# EAGLE design sensors-and-control-r1 (EAGLE 9.1.3)

## Sheet 1 of 3
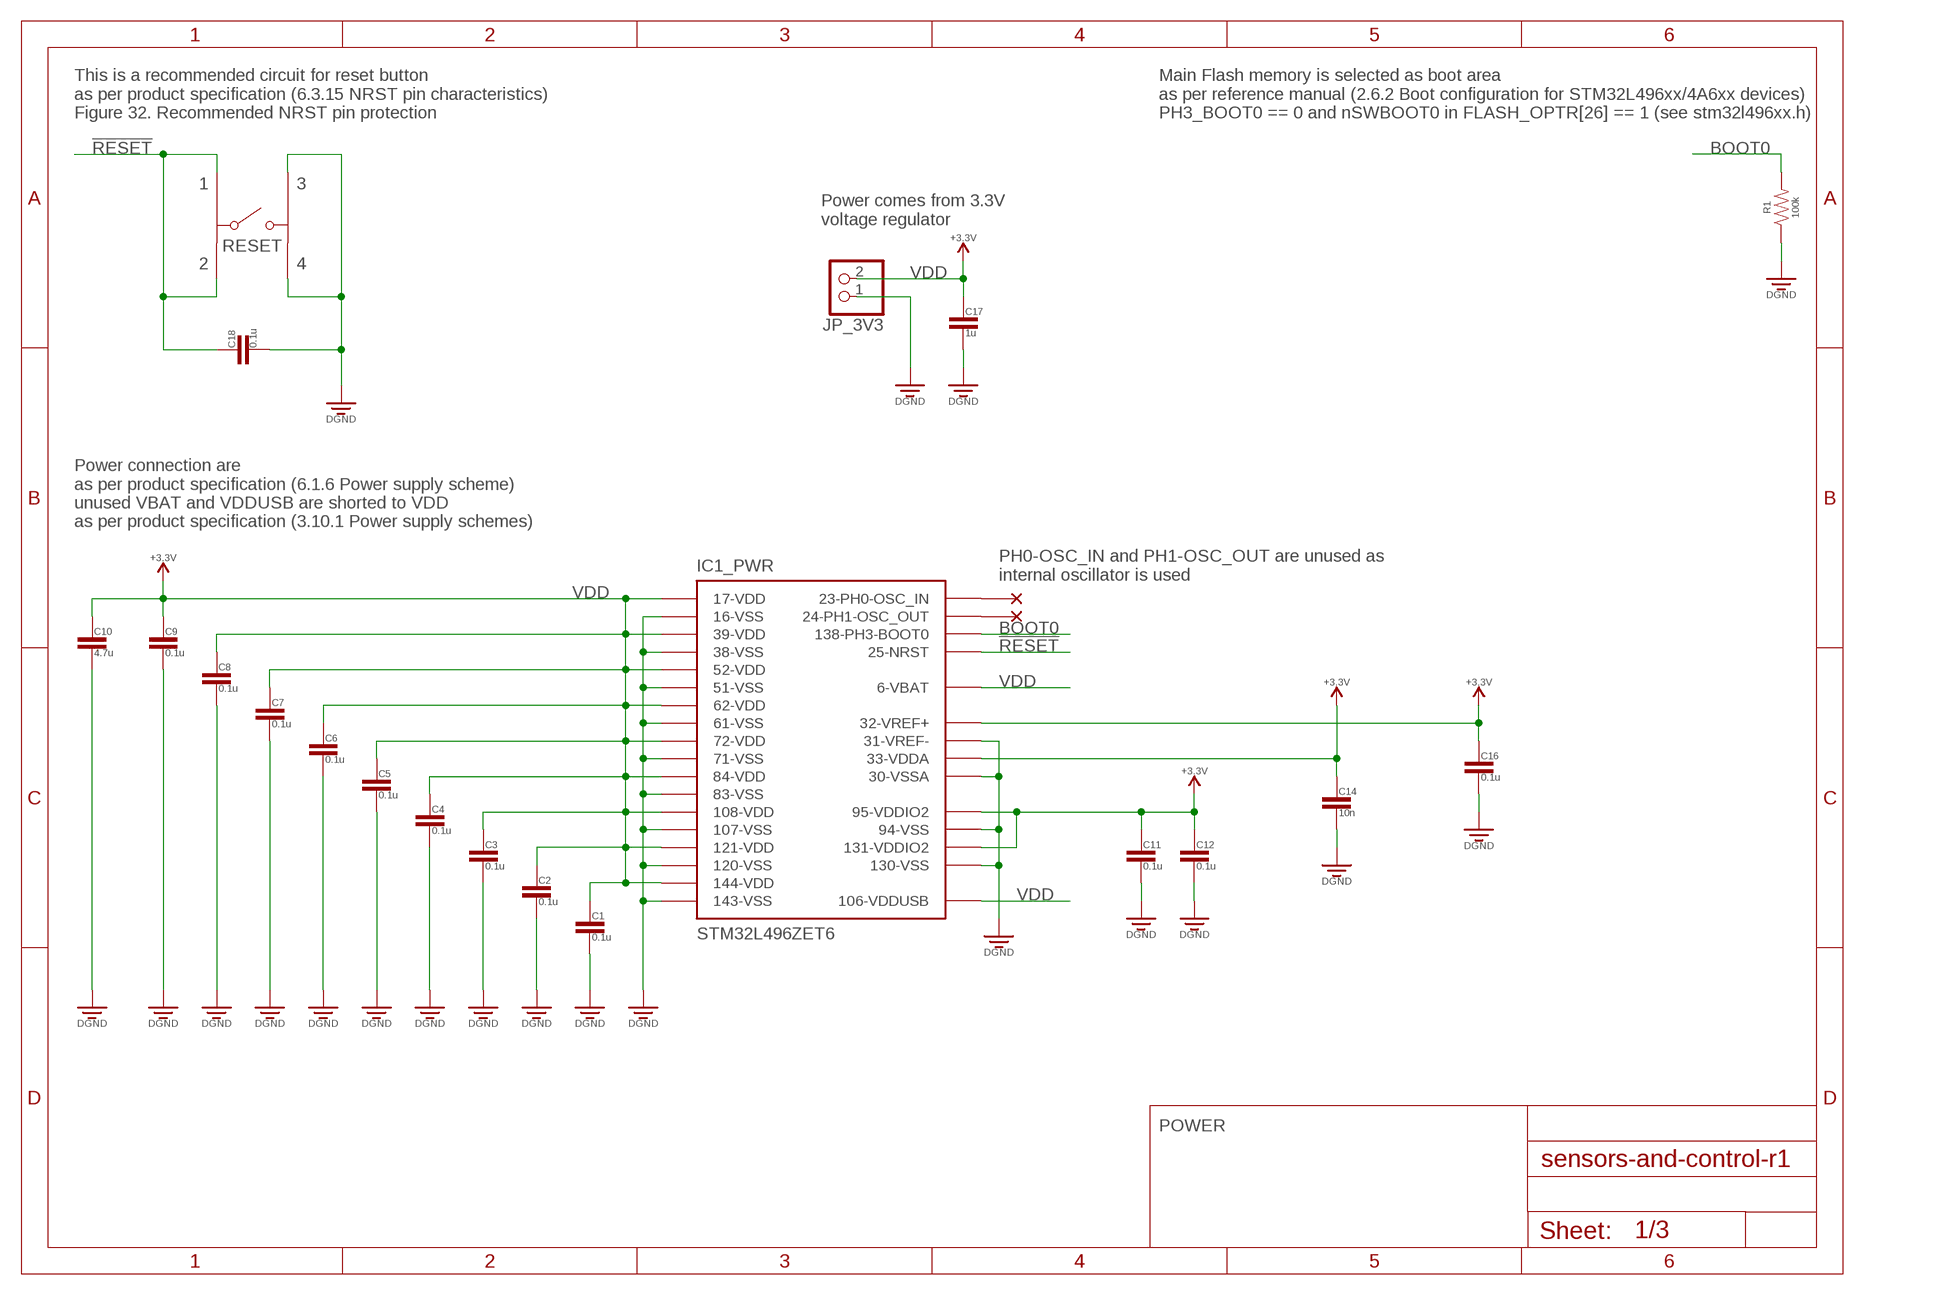
[diagram p0: schematic, sheet 1]

### Parts
C1  0.1u  CAPACITOR0603  [CAPACITOR-0603]
C2  0.1u  CAPACITOR0603  [CAPACITOR-0603]
C3  0.1u  CAPACITOR0603  [CAPACITOR-0603]
C4  0.1u  CAPACITOR0603  [CAPACITOR-0603]
C5  0.1u  CAPACITOR0603  [CAPACITOR-0603]
C6  0.1u  CAPACITOR0603  [CAPACITOR-0603]
C7  0.1u  CAPACITOR0603  [CAPACITOR-0603]
C8  0.1u  CAPACITOR0603  [CAPACITOR-0603]
C9  0.1u  CAPACITOR0603  [CAPACITOR-0603]
C10  4.7u  CAPACITOR0603  [CAPACITOR-0603]
C11  0.1u  CAPACITOR0603  [CAPACITOR-0603]
C12  0.1u  CAPACITOR0603  [CAPACITOR-0603]
C14  10n  CAPACITOR0603  [CAPACITOR-0603]
C16  0.1u  CAPACITOR0603  [CAPACITOR-0603]
C17  1u  CAPACITOR0603  [CAPACITOR-0603]
C18  0.1u  CAPACITOR0603  [CAPACITOR-0603]
IC1  STM32L496ZET6  [LQFP144_20X20]
JP_3V3  WURTH_691103110002  [2_PINS,3.5MM_PITCH]
R1  100k  RESISTOR_0.1W  [RESISTOR-0603]
RESET  FSM6JSMAASTR  [FSMJSM]
SUPPLY1  +3.3V  (no package)
SUPPLY2  +3.3V  (no package)
SUPPLY3  +3.3V  (no package)
SUPPLY4  +3.3V  (no package)
SUPPLY5  +3.3V  (no package)
U$2  NC  (no package)
U$3  NC  (no package)

### Nets
!RESET: C18.1 IC1.25(_PWR:25-NRST) RESET.P$2 RESET.P$4 ; also sheet 2
BOOT0: IC1.138(_PWR:138-PH3-BOOT0) R1.P$2
DGND: C1.2 C2.2 C3.2 C4.2 C5.2 C6.2 C7.2 C8.2 C9.2 C10.2 C11.2 C12.2 C14.2 C16.2 C17.2 C18.2 IC1.16(_PWR:16-VSS) IC1.30(_PWR:30-VSSA) IC1.31(_PWR:31-VREF-) IC1.38(_PWR:38-VSS) IC1.51(_PWR:51-VSS) IC1.61(_PWR:61-VSS) IC1.71(_PWR:71-VSS) IC1.83(_PWR:83-VSS) IC1.94(_PWR:94-VSS) IC1.107(_PWR:107-VSS) IC1.120(_PWR:120-VSS) IC1.130(_PWR:130-VSS) IC1.143(_PWR:143-VSS) JP_3V3.1 R1.P$1 RESET.P$1 RESET.P$3 ; also sheet 2,3
N$4: IC1.24(_PWR:24-PH1-OSC_OUT) U$2.1
N$5: IC1.23(_PWR:23-PH0-OSC_IN) U$3.1
VDD: C1.1 C2.1 C3.1 C4.1 C5.1 C6.1 C7.1 C8.1 C9.1 C10.1 C11.1 C12.1 C14.1 C16.1 C17.1 IC1.6(_PWR:6-VBAT) IC1.17(_PWR:17-VDD) IC1.32(_PWR:32-VREF+) IC1.33(_PWR:33-VDDA) IC1.39(_PWR:39-VDD) IC1.52(_PWR:52-VDD) IC1.62(_PWR:62-VDD) IC1.72(_PWR:72-VDD) IC1.84(_PWR:84-VDD) IC1.95(_PWR:95-VDDIO2) IC1.106(_PWR:106-VDDUSB) IC1.108(_PWR:108-VDD) IC1.121(_PWR:121-VDD) IC1.131(_PWR:131-VDDIO2) IC1.144(_PWR:144-VDD) JP_3V3.2 SUPPLY1.VCC SUPPLY2.VCC SUPPLY3.VCC SUPPLY4.VCC SUPPLY5.VCC ; also sheet 2,3

### Notes on the sheet
- This is a recommended circuit for reset button
  as per product specification (6.3.15 NRST pin characteristics)
  Figure 32. Recommended NRST pin protection
- Main Flash memory is selected as boot area
  as per reference manual (2.6.2 Boot configuration for STM32L496xx/4A6xx devices)
  PH3_BOOT0 == 0 and nSWBOOT0 in FLASH_OPTR[26] == 1 (see stm32l496xx.h)
- Power comes from 3.3V
  voltage regulator
- Power connection are
  as per product specification (6.1.6 Power supply scheme)
  unused VBAT and VDDUSB are shorted to VDD
  as per product specification (3.10.1 Power supply schemes)
- PH0-OSC_IN and PH1-OSC_OUT are unused as
  internal oscillator is used
- POWER

## Sheet 2 of 3
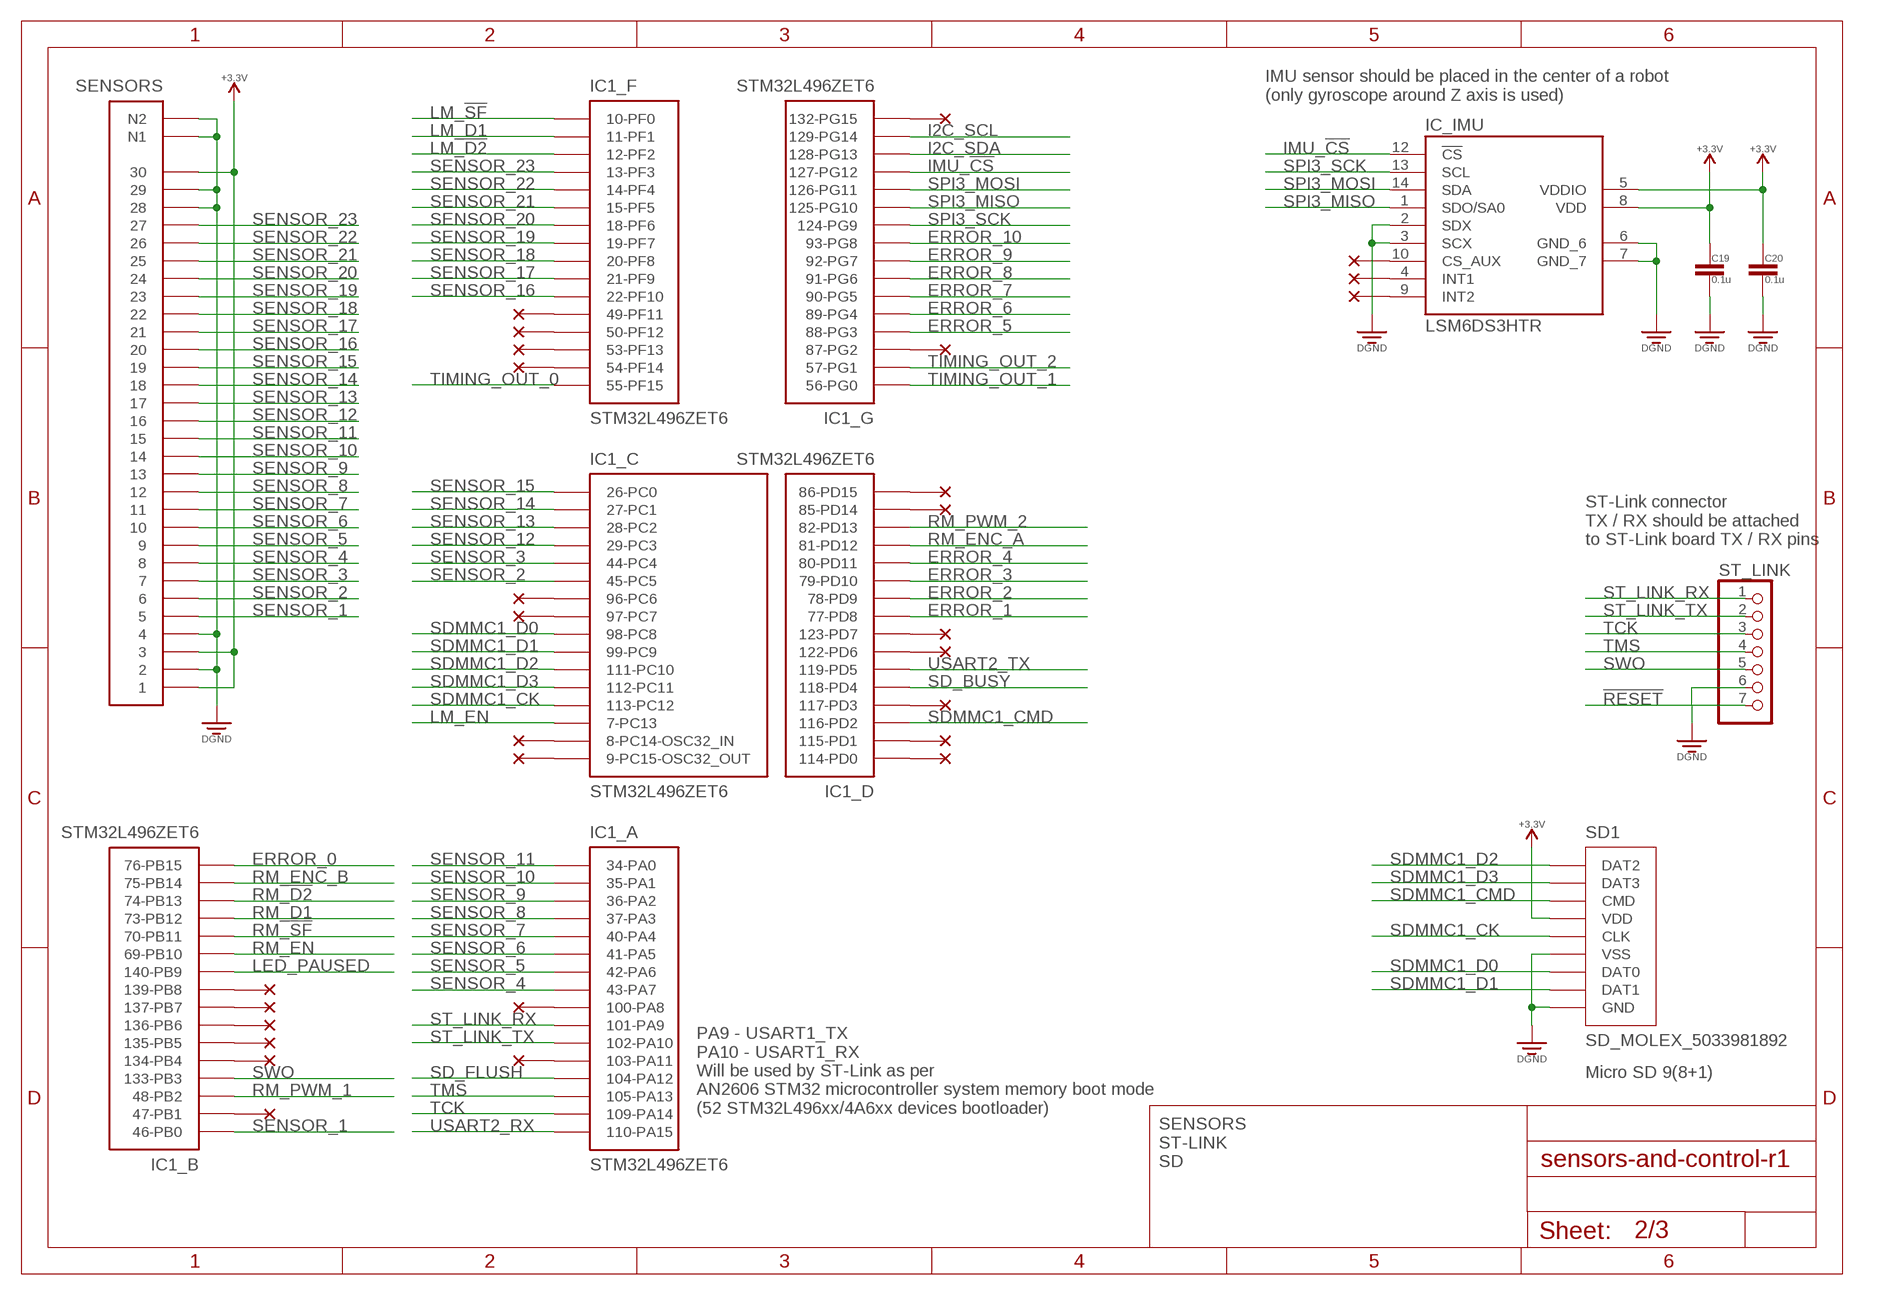
[diagram p1: schematic, sheet 2]

### Parts
C19  0.1u  CAPACITOR0603  [CAPACITOR-0603]
C20  0.1u  CAPACITOR0603  [CAPACITOR-0603]
IC_IMU  LSM6DS3HTR  [LGA-14L]
SD1  SD_MOLEX_5033981892  [SD_MOLEX_5033981892]
SENSORS  MOLEX-502046-3070  [MOLEX-502046-3070]
ST_LINK  PINHD-1X7  [1X07]
SUPPLY6  +3.3V  (no package)
SUPPLY7  +3.3V  (no package)
SUPPLY8  +3.3V  (no package)
SUPPLY9  +3.3V  (no package)
U$1  NC  (no package)
U$4  NC  (no package)
U$5  NC  (no package)
U$11  NC  (no package)
U$12  NC  (no package)
U$13  NC  (no package)
U$14  NC  (no package)
U$15  NC  (no package)
U$16  NC  (no package)
U$17  NC  (no package)
U$18  NC  (no package)
U$19  NC  (no package)
U$20  NC  (no package)
U$21  NC  (no package)
U$22  NC  (no package)
U$23  NC  (no package)
U$24  NC  (no package)
U$25  NC  (no package)
U$26  NC  (no package)
U$27  NC  (no package)
U$28  NC  (no package)
U$29  NC  (no package)
U$31  NC  (no package)
U$32  NC  (no package)
U$33  NC  (no package)
U$34  NC  (no package)
U$35  NC  (no package)
U$36  NC  (no package)

### Nets
!RESET: ST_LINK.7 ; also sheet 1
DGND: C19.2 C20.2 IC_IMU.2(SDX) IC_IMU.3(SCX) IC_IMU.6(GND_6) IC_IMU.7(GND_7) SD1.6(VSS) SD1.DLM(GND) SENSORS.2 SENSORS.4 SENSORS.28 SENSORS.29 SENSORS.NAIL1(N1) SENSORS.NAIL2(N2) ST_LINK.6 ; also sheet 1,3
ERROR_0: IC1.76(_B:76-PB15) ; also sheet 3
ERROR_1: IC1.77(_D:77-PD8) ; also sheet 3
ERROR_2: IC1.78(_D:78-PD9) ; also sheet 3
ERROR_3: IC1.79(_D:79-PD10) ; also sheet 3
ERROR_4: IC1.80(_D:80-PD11) ; also sheet 3
ERROR_5: IC1.88(_G:88-PG3) ; also sheet 3
ERROR_6: IC1.89(_G:89-PG4) ; also sheet 3
ERROR_7: IC1.90(_G:90-PG5) ; also sheet 3
ERROR_8: IC1.91(_G:91-PG6) ; also sheet 3
ERROR_9: IC1.92(_G:92-PG7) ; also sheet 3
ERROR_10: IC1.93(_G:93-PG8) ; also sheet 3
I2C_SCL: IC1.129(_G:129-PG14) ; also sheet 3
I2C_SDA: IC1.128(_G:128-PG13) ; also sheet 3
IMU_!CS: IC1.127(_G:127-PG12) IC_IMU.12(!CS!)
LED_PAUSED: IC1.140(_B:140-PB9) ; also sheet 3
LM_!D2: IC1.12(_F:12-PF2) ; also sheet 3
LM_!SF: IC1.10(_F:10-PF0) ; also sheet 3
LM_D1: IC1.11(_F:11-PF1) ; also sheet 3
LM_EN: IC1.7(_C:7-PC13) ; also sheet 3
N$1: IC_IMU.10(CS_AUX) U$1.1
N$2: IC_IMU.4(INT1) U$4.1
N$6: IC_IMU.9(INT2) U$5.1
N$27: IC1.114(_D:114-PD0) U$11.1
N$28: IC1.115(_D:115-PD1) U$12.1
N$29: IC1.117(_D:117-PD3) U$13.1
N$30: IC1.103(_A:103-PA11) U$14.1
N$31: IC1.122(_D:122-PD6) U$15.1
N$32: IC1.123(_D:123-PD7) U$16.1
N$33: IC1.85(_D:85-PD14) U$17.1
N$34: IC1.86(_D:86-PD15) U$18.1
N$35: IC1.87(_G:87-PG2) U$19.1
N$36: IC1.49(_F:49-PF11) U$20.1
N$37: IC1.50(_F:50-PF12) U$21.1
N$38: IC1.53(_F:53-PF13) U$22.1
N$39: IC1.54(_F:54-PF14) U$23.1
N$40: IC1.96(_C:96-PC6) U$24.1
N$41: IC1.97(_C:97-PC7) U$25.1
N$42: IC1.8(_C:8-PC14-OSC32_IN) U$26.1
N$43: IC1.9(_C:9-PC15-OSC32_OUT) U$27.1
N$44: IC1.100(_A:100-PA8) U$28.1
N$45: IC1.132(_G:132-PG15) U$29.1
N$47: IC1.137(_B:137-PB7) U$31.1
N$48: IC1.139(_B:139-PB8) U$32.1
N$49: IC1.136(_B:136-PB6) U$33.1
N$50: IC1.135(_B:135-PB5) U$34.1
N$51: IC1.134(_B:134-PB4) U$35.1
N$52: IC1.47(_B:47-PB1) U$36.1
RM_!D2: IC1.74(_B:74-PB13) ; also sheet 3
RM_!SF: IC1.70(_B:70-PB11) ; also sheet 3
RM_D1: IC1.73(_B:73-PB12) ; also sheet 3
RM_EN: IC1.69(_B:69-PB10) ; also sheet 3
RM_ENC_A: IC1.81(_D:81-PD12) ; also sheet 3
RM_ENC_B: IC1.75(_B:75-PB14) ; also sheet 3
RM_PWM_1: IC1.48(_B:48-PB2) ; also sheet 3
RM_PWM_2: IC1.82(_D:82-PD13) ; also sheet 3
SD_BUSY: IC1.118(_D:118-PD4) ; also sheet 3
SD_FLUSH: IC1.104(_A:104-PA12) ; also sheet 3
SDMMC1_CK: IC1.113(_C:113-PC12) SD1.5(CLK)
SDMMC1_CMD: IC1.116(_D:116-PD2) SD1.3(CMD)
SDMMC1_D0: IC1.98(_C:98-PC8) SD1.7(DAT0)
SDMMC1_D1: IC1.99(_C:99-PC9) SD1.8(DAT1)
SDMMC1_D2: IC1.111(_C:111-PC10) SD1.1(DAT2)
SDMMC1_D3: IC1.112(_C:112-PC11) SD1.2(DAT3)
SENSOR_1: IC1.46(_B:46-PB0) SENSORS.5
SENSOR_2: IC1.45(_C:45-PC5) SENSORS.6
SENSOR_3: IC1.44(_C:44-PC4) SENSORS.7
SENSOR_4: IC1.43(_A:43-PA7) SENSORS.8
SENSOR_5: IC1.42(_A:42-PA6) SENSORS.9
SENSOR_6: IC1.41(_A:41-PA5) SENSORS.10
SENSOR_7: IC1.40(_A:40-PA4) SENSORS.11
SENSOR_8: IC1.37(_A:37-PA3) SENSORS.12
SENSOR_9: IC1.36(_A:36-PA2) SENSORS.13
SENSOR_10: IC1.35(_A:35-PA1) SENSORS.14
SENSOR_11: IC1.34(_A:34-PA0) SENSORS.15
SENSOR_12: IC1.29(_C:29-PC3) SENSORS.16
SENSOR_13: IC1.28(_C:28-PC2) SENSORS.17
SENSOR_14: IC1.27(_C:27-PC1) SENSORS.18
SENSOR_15: IC1.26(_C:26-PC0) SENSORS.19
SENSOR_16: IC1.22(_F:22-PF10) SENSORS.20
SENSOR_17: IC1.21(_F:21-PF9) SENSORS.21
SENSOR_18: IC1.20(_F:20-PF8) SENSORS.22
SENSOR_19: IC1.19(_F:19-PF7) SENSORS.23
SENSOR_20: IC1.18(_F:18-PF6) SENSORS.24
SENSOR_21: IC1.15(_F:15-PF5) SENSORS.25
SENSOR_22: IC1.14(_F:14-PF4) SENSORS.26
SENSOR_23: IC1.13(_F:13-PF3) SENSORS.27
SPI3_MISO: IC1.125(_G:125-PG10) IC_IMU.1(SDO/SA0)
SPI3_MOSI: IC1.126(_G:126-PG11) IC_IMU.14(SDA)
SPI3_SCK: IC1.124(_G:124-PG9) IC_IMU.13(SCL)
ST_LINK_RX: IC1.101(_A:101-PA9) ST_LINK.1
ST_LINK_TX: IC1.102(_A:102-PA10) ST_LINK.2
SWO: IC1.133(_B:133-PB3) ST_LINK.5
TCK: IC1.109(_A:109-PA14) ST_LINK.3
TIMING_OUT_0: IC1.55(_F:55-PF15) ; also sheet 3
TIMING_OUT_1: IC1.56(_G:56-PG0) ; also sheet 3
TIMING_OUT_2: IC1.57(_G:57-PG1) ; also sheet 3
TMS: IC1.105(_A:105-PA13) ST_LINK.4
USART2_RX: IC1.110(_A:110-PA15) ; also sheet 3
USART2_TX: IC1.119(_D:119-PD5) ; also sheet 3
VDD: C19.1 C20.1 IC_IMU.5(VDDIO) IC_IMU.8(VDD) SD1.4(VDD) SENSORS.1 SENSORS.3 SENSORS.30 SUPPLY6.VCC SUPPLY7.VCC SUPPLY8.VCC SUPPLY9.VCC ; also sheet 1,3

### Notes on the sheet
- IMU sensor should be placed in the center of a robot
  (only gyroscope around Z axis is used)
- ST-Link connector
  TX / RX should be attached
  to ST-Link board TX / RX pins
- Micro SD 9(8+1)
- PA9 - USART1_TX
  PA10 - USART1_RX
  Will be used by ST-Link as per
  AN2606 STM32 microcontroller system memory boot mode
  (52 STM32L496xx/4A6xx devices bootloader)
- SENSORS
  ST-LINK
  SD

## Sheet 3 of 3
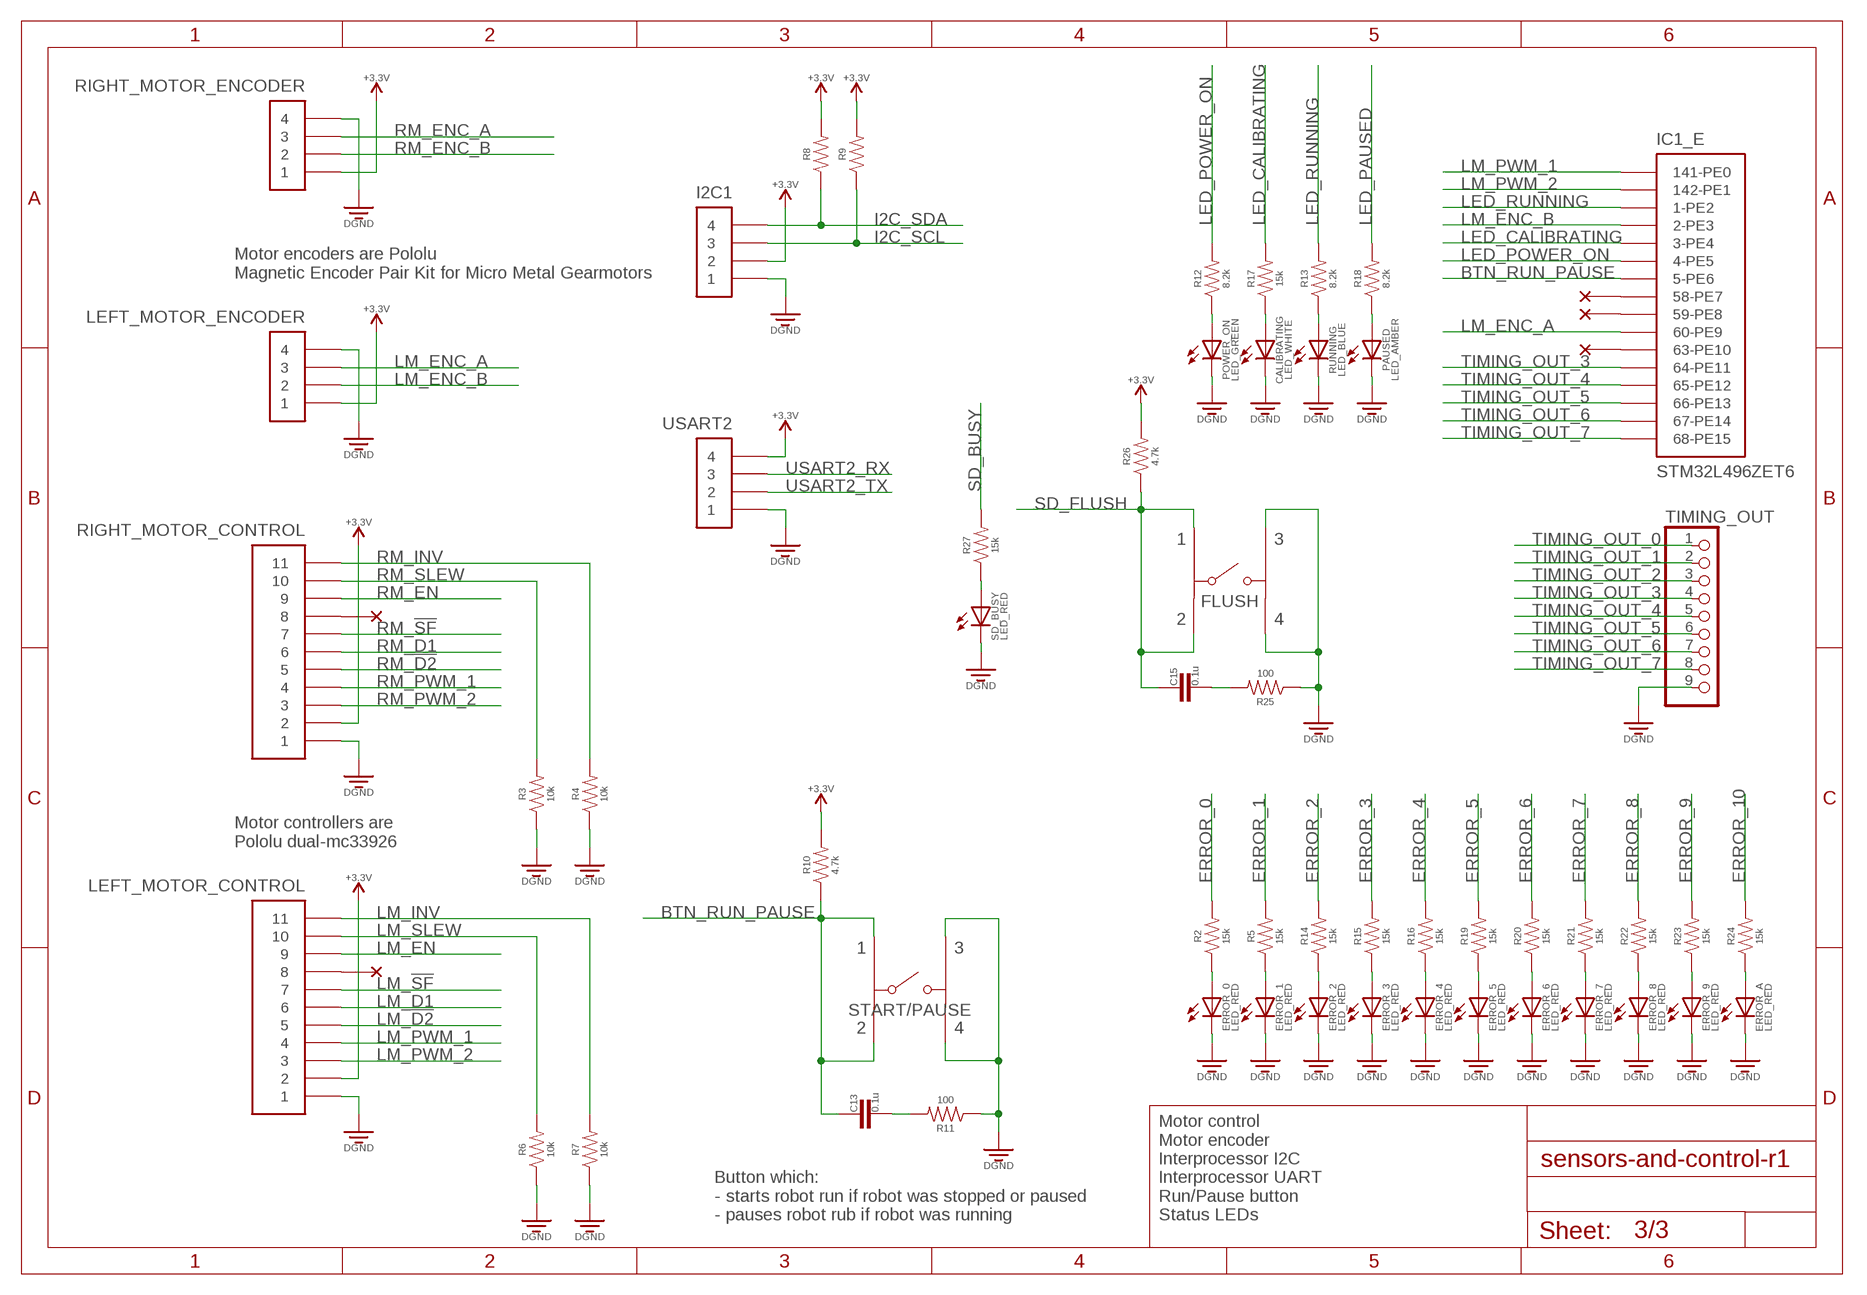
[diagram p2: schematic, sheet 3]

### Parts
C13  0.1u  CAPACITOR0603  [CAPACITOR-0603]
C15  0.1u  CAPACITOR0603  [CAPACITOR-0603]
CALIBRATING  LED_WHITE  [ESS_II_TYPE_LED]
ERROR_0  LED_RED  [ESS_II_TYPE_LED]
ERROR_1  LED_RED  [ESS_II_TYPE_LED]
ERROR_2  LED_RED  [ESS_II_TYPE_LED]
ERROR_3  LED_RED  [ESS_II_TYPE_LED]
ERROR_4  LED_RED  [ESS_II_TYPE_LED]
ERROR_5  LED_RED  [ESS_II_TYPE_LED]
ERROR_6  LED_RED  [ESS_II_TYPE_LED]
ERROR_7  LED_RED  [ESS_II_TYPE_LED]
ERROR_8  LED_RED  [ESS_II_TYPE_LED]
ERROR_9  LED_RED  [ESS_II_TYPE_LED]
ERROR_A  LED_RED  [ESS_II_TYPE_LED]
FLUSH  FSM6JSMAASTR  [FSMJSM]
I2C1  1X4  [MOLEX-70553-0003]
LEFT_MOTOR_CONTROL  1X11  [MOLEX-70553-0010]
LEFT_MOTOR_ENCODER  1X4  [MOLEX-70553-0003]
PAUSED  LED_AMBER  [ESS_II_TYPE_LED]
POWER_ON  LED_GREEN  [ESS_II_TYPE_LED]
R2  15k  RESISTOR_0.1W  [RESISTOR-0603]
R3  10k  RESISTOR_0.1W  [RESISTOR-0603]
R4  10k  RESISTOR_0.1W  [RESISTOR-0603]
R5  15k  RESISTOR_0.1W  [RESISTOR-0603]
R6  10k  RESISTOR_0.1W  [RESISTOR-0603]
R7  10k  RESISTOR_0.1W  [RESISTOR-0603]
R8  RESISTOR_0.1W  [RESISTOR-0603]
R9  RESISTOR_0.1W  [RESISTOR-0603]
R10  4.7k  RESISTOR_0.1W  [RESISTOR-0603]
R11  100  RESISTOR_0.1W  [RESISTOR-0603]
R12  8.2k  RESISTOR_0.1W  [RESISTOR-0603]
R13  8.2k  RESISTOR_0.1W  [RESISTOR-0603]
R14  15k  RESISTOR_0.1W  [RESISTOR-0603]
R15  15k  RESISTOR_0.1W  [RESISTOR-0603]
R16  15k  RESISTOR_0.1W  [RESISTOR-0603]
R17  15k  RESISTOR_0.1W  [RESISTOR-0603]
R18  8.2k  RESISTOR_0.1W  [RESISTOR-0603]
R19  15k  RESISTOR_0.1W  [RESISTOR-0603]
R20  15k  RESISTOR_0.1W  [RESISTOR-0603]
R21  15k  RESISTOR_0.1W  [RESISTOR-0603]
R22  15k  RESISTOR_0.1W  [RESISTOR-0603]
R23  15k  RESISTOR_0.1W  [RESISTOR-0603]
R24  15k  RESISTOR_0.1W  [RESISTOR-0603]
R25  100  RESISTOR_0.1W  [RESISTOR-0603]
R26  4.7k  RESISTOR_0.1W  [RESISTOR-0603]
R27  15k  RESISTOR_0.1W  [RESISTOR-0603]
RIGHT_MOTOR_CONTROL  1X11  [MOLEX-70553-0010]
RIGHT_MOTOR_ENCODER  1X4  [MOLEX-70553-0003]
RUNNING  LED_BLUE  [ESS_II_TYPE_LED]
SD_BUSY  LED_RED  [ESS_II_TYPE_LED]
START/PAUSE  FSM6JSMAASTR  [FSMJSM]
SUPPLY10  +3.3V  (no package)
SUPPLY11  +3.3V  (no package)
SUPPLY12  +3.3V  (no package)
SUPPLY13  +3.3V  (no package)
SUPPLY16  +3.3V  (no package)
SUPPLY17  +3.3V  (no package)
SUPPLY18  +3.3V  (no package)
SUPPLY19  +3.3V  (no package)
SUPPLY20  +3.3V  (no package)
TIMING_OUT  PINHD-1X9  [1X09]
U$6  NC  (no package)
U$7  NC  (no package)
U$8  NC  (no package)
U$9  NC  (no package)
U$10  NC  (no package)
USART2  1X4  [MOLEX-70553-0003]
VDD  +3.3V  (no package)

### Nets
BTN_RUN_PAUSE: C13.1 IC1.5(_E:5-PE6) R10.P$1 START/PAUSE.P$2 START/PAUSE.P$4
DGND: CALIBRATING.P$2(C) ERROR_0.P$2(C) ERROR_1.P$2(C) ERROR_2.P$2(C) ERROR_3.P$2(C) ERROR_4.P$2(C) ERROR_5.P$2(C) ERROR_6.P$2(C) ERROR_7.P$2(C) ERROR_8.P$2(C) ERROR_9.P$2(C) ERROR_A.P$2(C) FLUSH.P$1 FLUSH.P$3 I2C1.1 LEFT_MOTOR_CONTROL.P$1 LEFT_MOTOR_ENCODER.4 PAUSED.P$2(C) POWER_ON.P$2(C) R3.P$1 R4.P$1 R6.P$1 R7.P$1 R11.P$1 R25.P$1 RIGHT_MOTOR_CONTROL.P$1 RIGHT_MOTOR_ENCODER.4 RUNNING.P$2(C) SD_BUSY.P$2(C) START/PAUSE.P$1 START/PAUSE.P$3 TIMING_OUT.9 USART2.1 ; also sheet 1,2
ERROR_0: R2.P$2 ; also sheet 2
ERROR_1: R5.P$2 ; also sheet 2
ERROR_2: R14.P$2 ; also sheet 2
ERROR_3: R15.P$2 ; also sheet 2
ERROR_4: R16.P$2 ; also sheet 2
ERROR_5: R19.P$2 ; also sheet 2
ERROR_6: R20.P$2 ; also sheet 2
ERROR_7: R21.P$2 ; also sheet 2
ERROR_8: R22.P$2 ; also sheet 2
ERROR_9: R23.P$2 ; also sheet 2
ERROR_10: R24.P$2 ; also sheet 2
I2C_SCL: I2C1.3 R9.P$1 ; also sheet 2
I2C_SDA: I2C1.4 R8.P$1 ; also sheet 2
LED_CALIBRATING: IC1.3(_E:3-PE4) R17.P$2
LED_PAUSED: R18.P$2 ; also sheet 2
LED_POWER_ON: IC1.4(_E:4-PE5) R12.P$2
LED_RUNNING: IC1.1(_E:1-PE2) R13.P$2
LM_!D2: LEFT_MOTOR_CONTROL.P$5 ; also sheet 2
LM_!SF: LEFT_MOTOR_CONTROL.P$7 ; also sheet 2
LM_D1: LEFT_MOTOR_CONTROL.P$6 ; also sheet 2
LM_EN: LEFT_MOTOR_CONTROL.P$9 ; also sheet 2
LM_ENC_A: IC1.60(_E:60-PE9) LEFT_MOTOR_ENCODER.3
LM_ENC_B: IC1.2(_E:2-PE3) LEFT_MOTOR_ENCODER.2
LM_INV: LEFT_MOTOR_CONTROL.P$11 R7.P$2
LM_PWM_1: IC1.141(_E:141-PE0) LEFT_MOTOR_CONTROL.P$4
LM_PWM_2: IC1.142(_E:142-PE1) LEFT_MOTOR_CONTROL.P$3
LM_SLEW: LEFT_MOTOR_CONTROL.P$10 R6.P$2
N$3: ERROR_0.P$1(A) R2.P$1
N$7: RIGHT_MOTOR_CONTROL.P$8 U$6.1
N$8: LEFT_MOTOR_CONTROL.P$8 U$7.1
N$9: ERROR_1.P$1(A) R5.P$1
N$10: POWER_ON.P$1(A) R12.P$1
N$11: C13.2 R11.P$2
N$12: R13.P$1 RUNNING.P$1(A)
N$13: ERROR_2.P$1(A) R14.P$1
N$14: ERROR_3.P$1(A) R15.P$1
N$15: ERROR_4.P$1(A) R16.P$1
N$16: CALIBRATING.P$1(A) R17.P$1
N$17: PAUSED.P$1(A) R18.P$1
N$18: ERROR_5.P$1(A) R19.P$1
N$19: ERROR_6.P$1(A) R20.P$1
N$20: ERROR_7.P$1(A) R21.P$1
N$21: ERROR_8.P$1(A) R22.P$1
N$22: ERROR_9.P$1(A) R23.P$1
N$23: ERROR_A.P$1(A) R24.P$1
N$24: IC1.63(_E:63-PE10) U$8.1
N$25: IC1.59(_E:59-PE8) U$9.1
N$26: IC1.58(_E:58-PE7) U$10.1
N$53: C15.2 R25.P$2
N$55: R27.P$1 SD_BUSY.P$1(A)
RM_!D2: RIGHT_MOTOR_CONTROL.P$5 ; also sheet 2
RM_!SF: RIGHT_MOTOR_CONTROL.P$7 ; also sheet 2
RM_D1: RIGHT_MOTOR_CONTROL.P$6 ; also sheet 2
RM_EN: RIGHT_MOTOR_CONTROL.P$9 ; also sheet 2
RM_ENC_A: RIGHT_MOTOR_ENCODER.3 ; also sheet 2
RM_ENC_B: RIGHT_MOTOR_ENCODER.2 ; also sheet 2
RM_INV: R4.P$2 RIGHT_MOTOR_CONTROL.P$11
RM_PWM_1: RIGHT_MOTOR_CONTROL.P$4 ; also sheet 2
RM_PWM_2: RIGHT_MOTOR_CONTROL.P$3 ; also sheet 2
RM_SLEW: R3.P$2 RIGHT_MOTOR_CONTROL.P$10
SD_BUSY: R27.P$2 ; also sheet 2
SD_FLUSH: C15.1 FLUSH.P$2 FLUSH.P$4 R26.P$1 ; also sheet 2
TIMING_OUT_0: TIMING_OUT.1 ; also sheet 2
TIMING_OUT_1: TIMING_OUT.2 ; also sheet 2
TIMING_OUT_2: TIMING_OUT.3 ; also sheet 2
TIMING_OUT_3: IC1.64(_E:64-PE11) TIMING_OUT.4
TIMING_OUT_4: IC1.65(_E:65-PE12) TIMING_OUT.5
TIMING_OUT_5: IC1.66(_E:66-PE13) TIMING_OUT.6
TIMING_OUT_6: IC1.67(_E:67-PE14) TIMING_OUT.7
TIMING_OUT_7: IC1.68(_E:68-PE15) TIMING_OUT.8
USART2_RX: USART2.3 ; also sheet 2
USART2_TX: USART2.2 ; also sheet 2
VDD: I2C1.2 LEFT_MOTOR_CONTROL.P$2 LEFT_MOTOR_ENCODER.1 R8.P$2 R9.P$2 R10.P$2 R26.P$2 RIGHT_MOTOR_CONTROL.P$2 RIGHT_MOTOR_ENCODER.1 SUPPLY10.VCC SUPPLY11.VCC SUPPLY12.VCC SUPPLY13.VCC SUPPLY16.VCC SUPPLY17.VCC SUPPLY18.VCC SUPPLY19.VCC SUPPLY20.VCC USART2.4 VDD.VCC ; also sheet 1,2

### Notes on the sheet
- Motor encoders are Pololu
  Magnetic Encoder Pair Kit for Micro Metal Gearmotors
- Motor controllers are
  Pololu dual-mc33926
- Button which:
  - starts robot run if robot was stopped or paused
  - pauses robot rub if robot was running
- Motor control
  Motor encoder
  Interprocessor I2C
  Interprocessor UART
  Run/Pause button
  Status LEDs

## Library data of the parts
C1-C20 = capacitors:CAPACITOR
CALIBRATING = led:LED_WHITE
ERROR_0 ERROR_1-ERROR_9 ERROR_A SD_BUSY = led:LED_RED
FLUSH RESET START/PAUSE = switches:FSM6JSMAASTR
I2C1 LEFT_MOTOR_ENCODER RIGHT_MOTOR_ENCODER USART2 = connectors:1X4
IC1 = mcu:STM32L496ZET6
IC_IMU = sensors:LSM6DS3HTR
JP_3V3 = connectors-power:WURTH_691103110002
LEFT_MOTOR_CONTROL RIGHT_MOTOR_CONTROL = connectors:1X11
PAUSED = led:LED_AMBER
POWER_ON = led:LED_GREEN
R1-R27 = resistors:RESISTOR_0.1W
RUNNING = led:LED_BLUE
SD1 = memory-card-interfaces:SD_MOLEX_5033981892
SENSORS = connectors:MOLEX-502046-3070
ST_LINK = pin-headers:PINHD-1X7: PIN HEADER
SUPPLY1-SUPPLY13 SUPPLY16-SUPPLY20 VDD = voltage-ground:+3.3V: +3.3V Voltage Supply Positive voltage supply (traditionally for a BJT device, C=collector).
TIMING_OUT = pin-headers:PINHD-1X9: PIN HEADER
U$1-U$29 U$31-U$36 = voltage-ground:NC

## Board
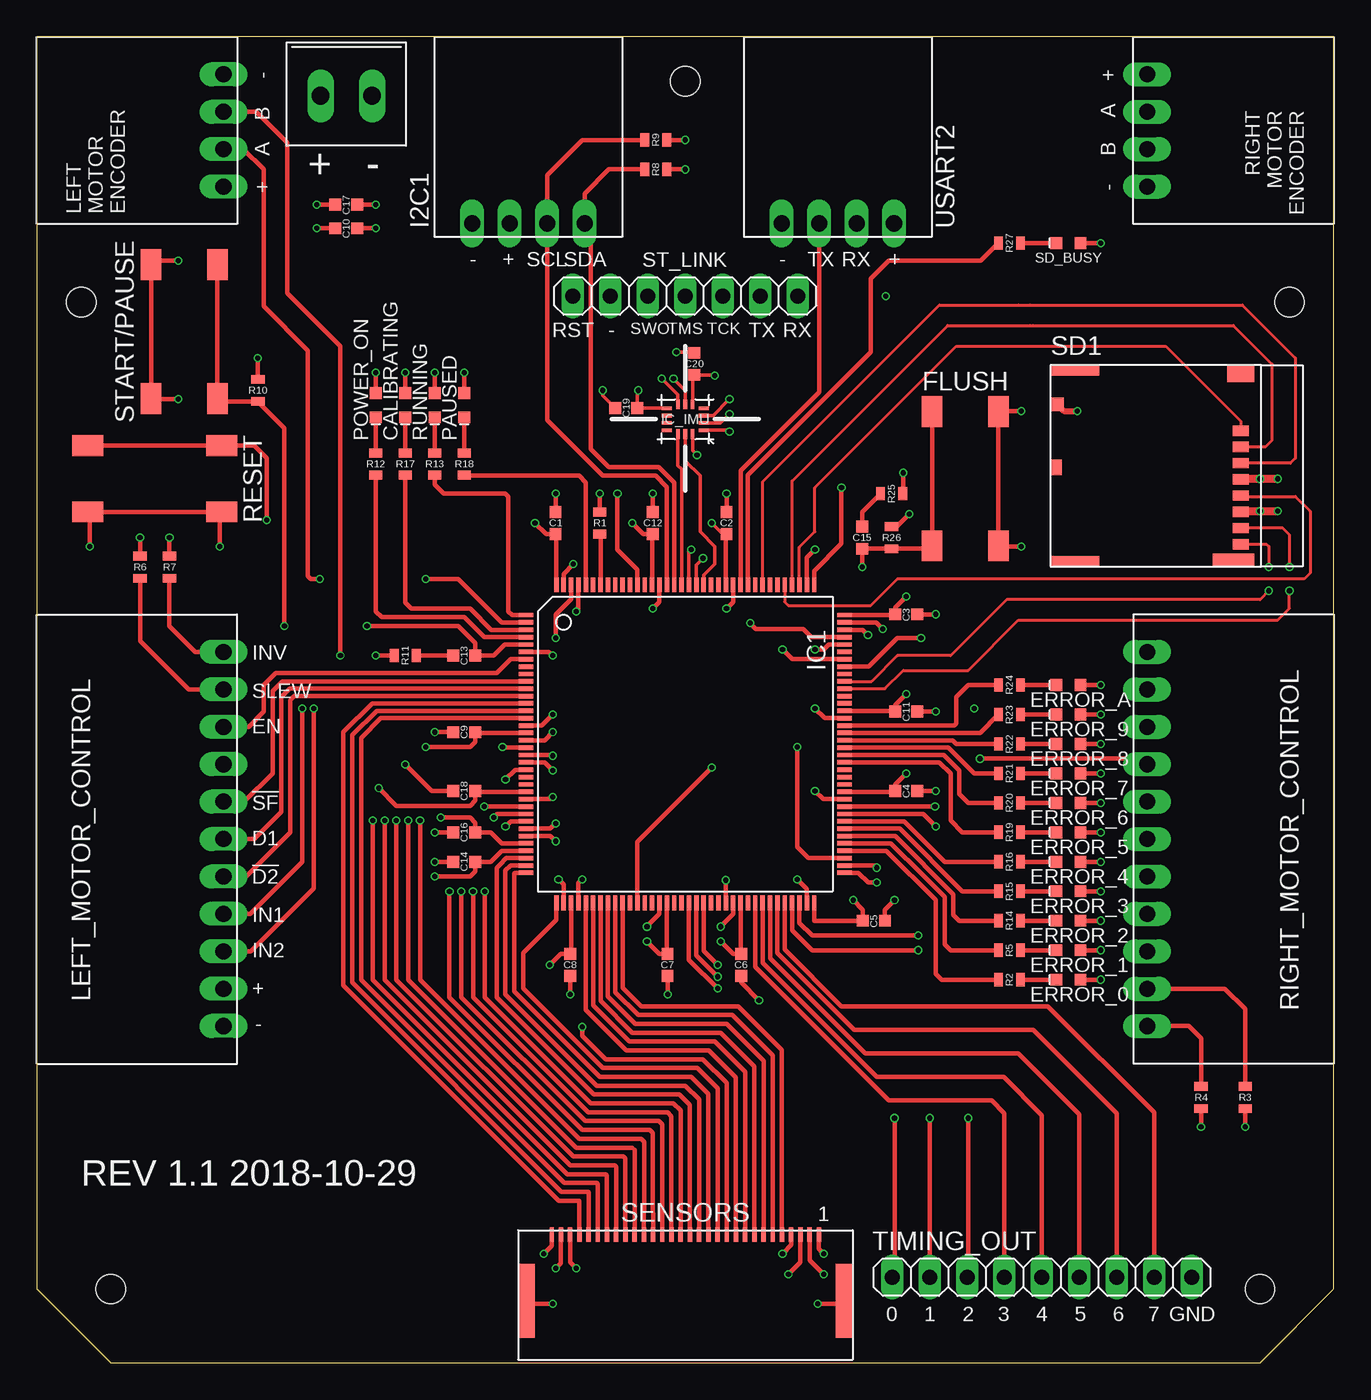
[diagram p3: board, top side]
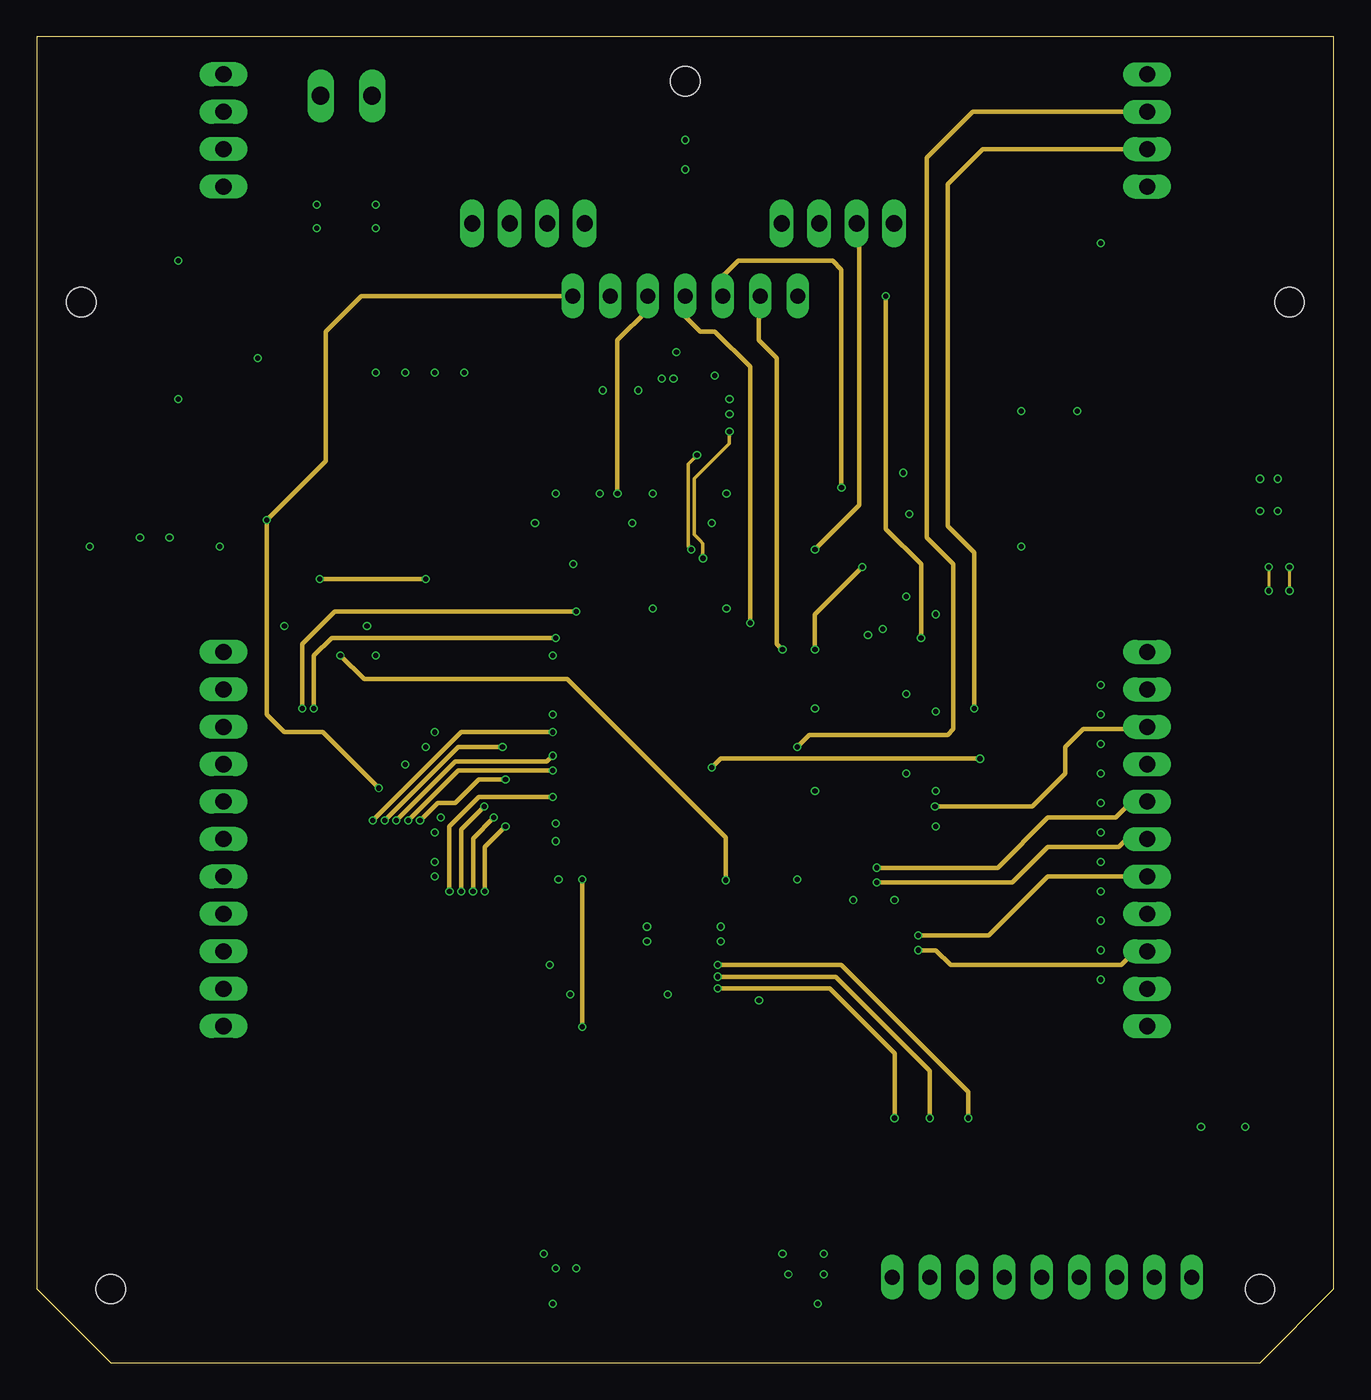
[diagram p4: board, inner layer Route2]
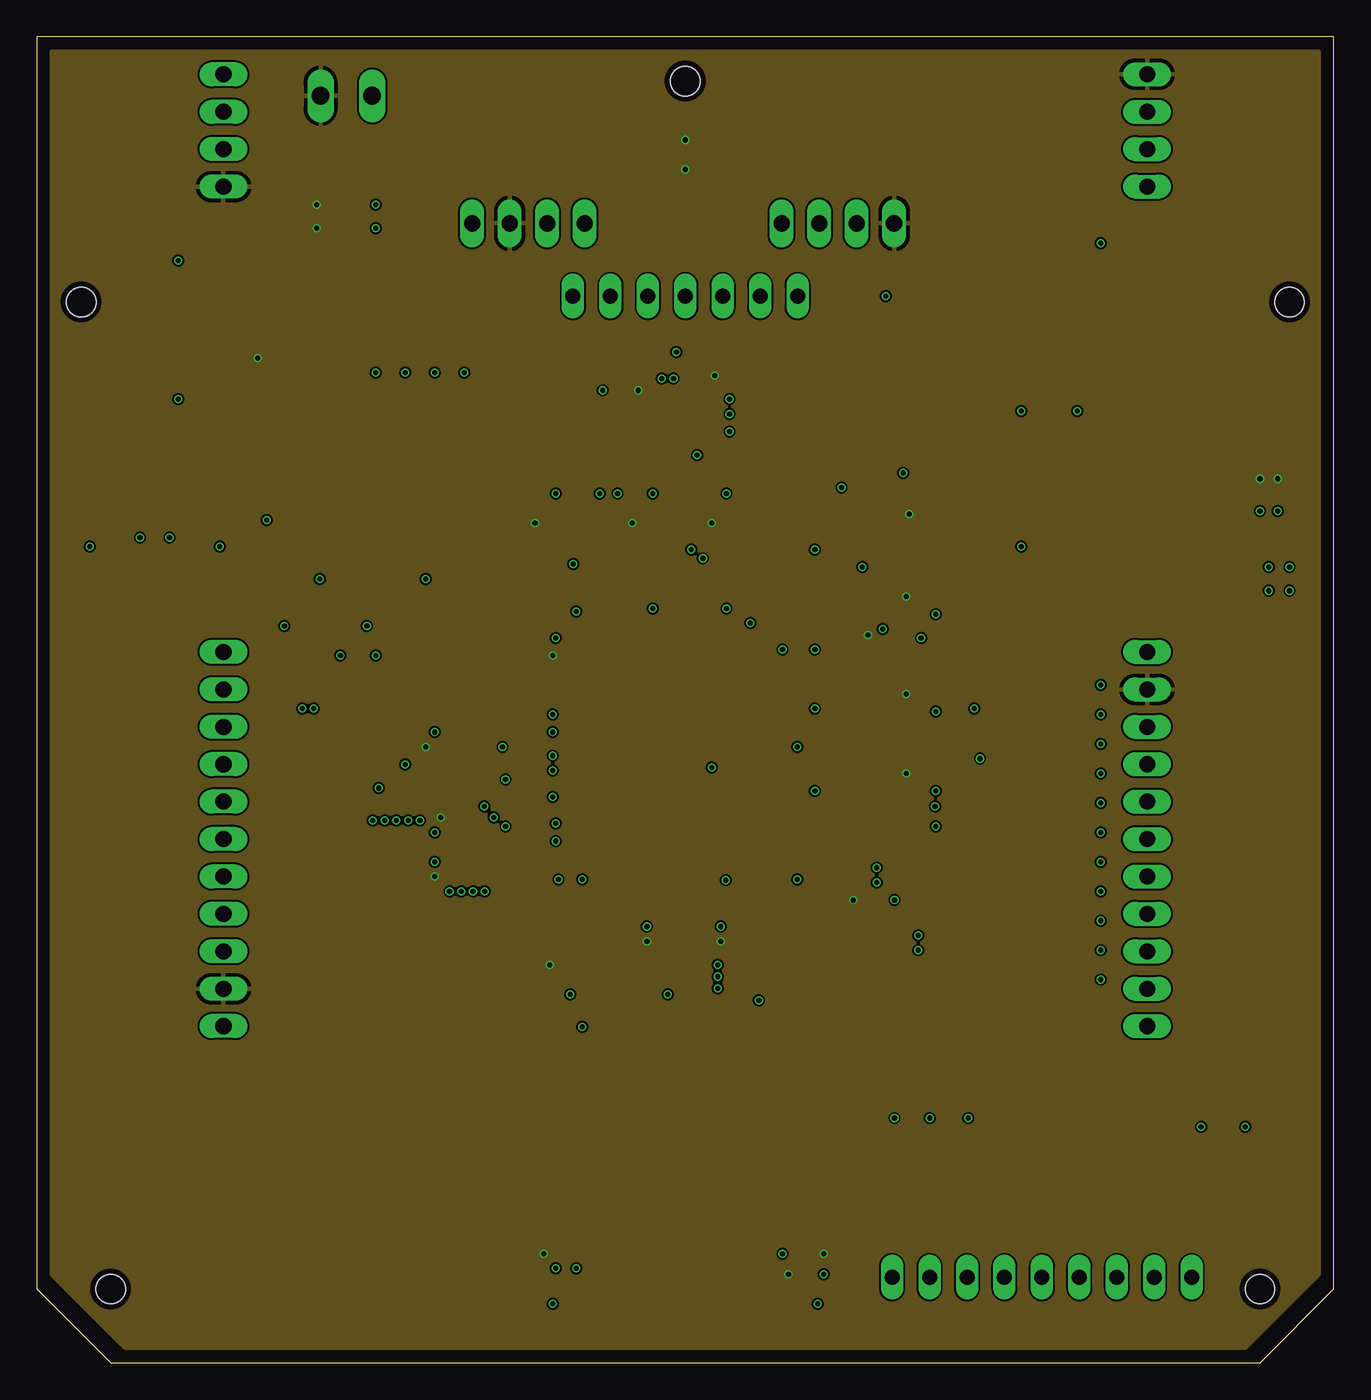
[diagram p5: board, inner layer Route15]
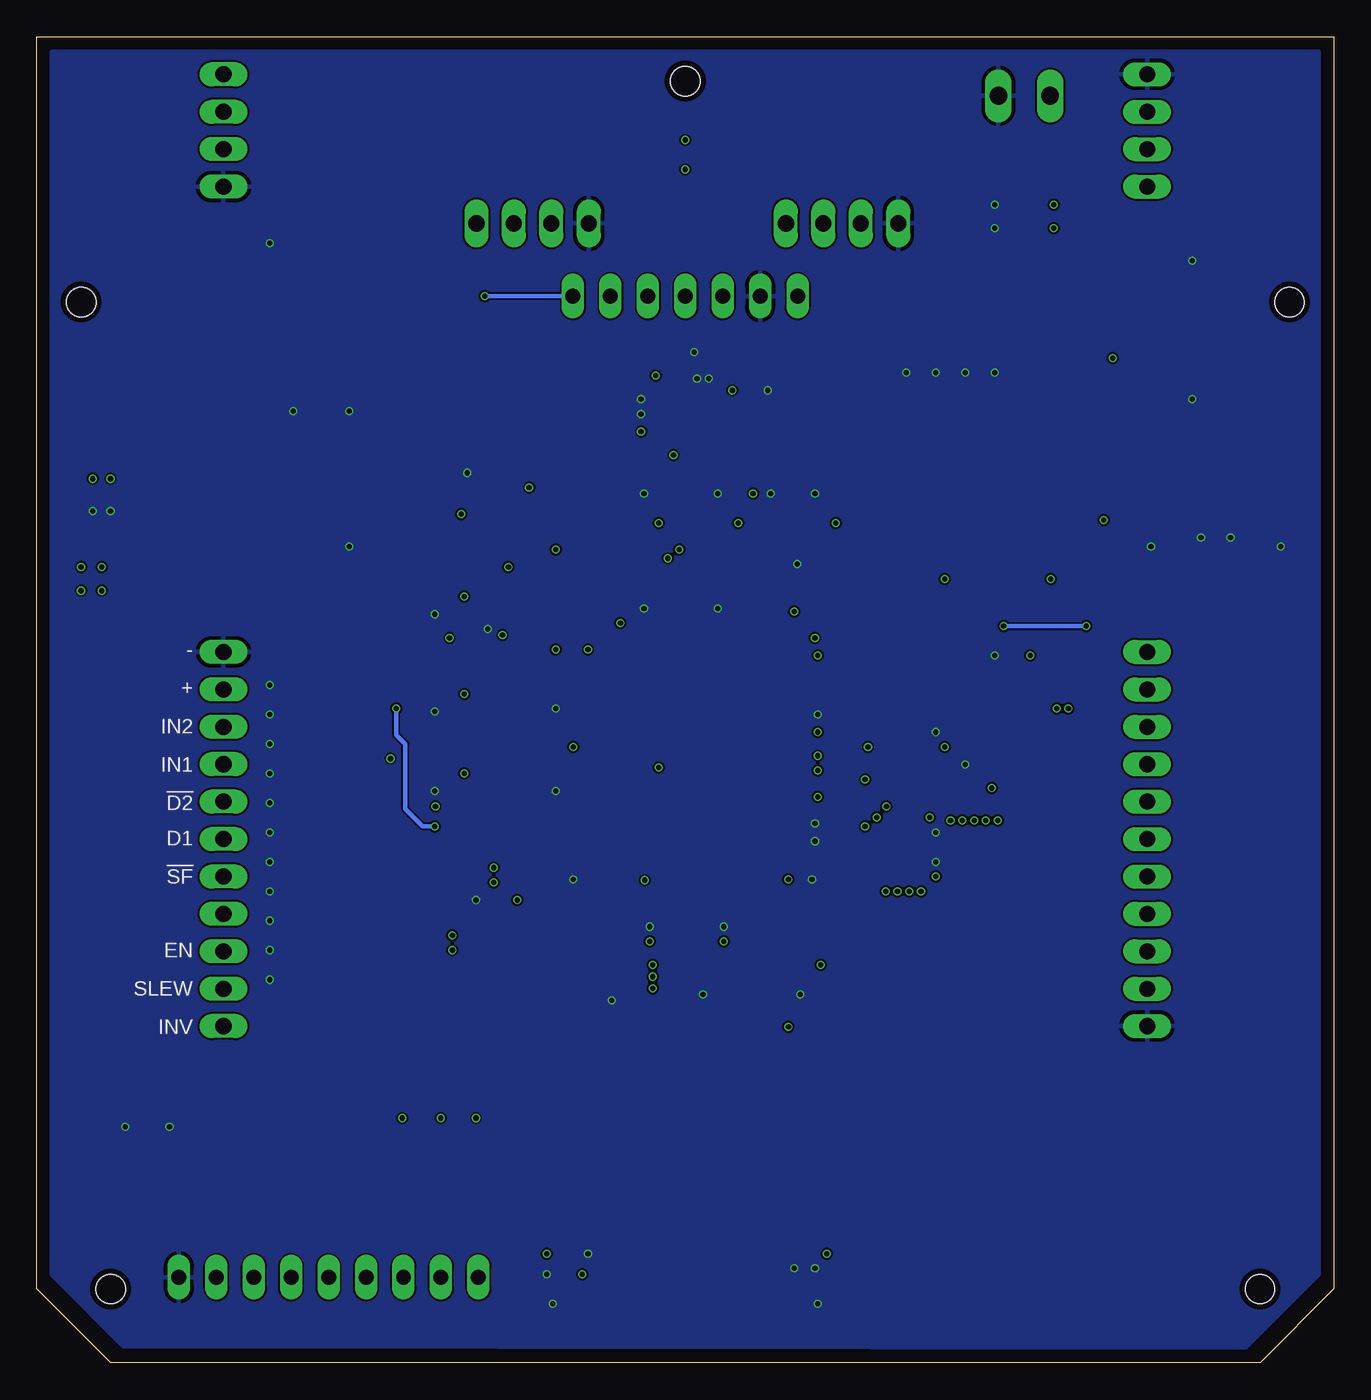
[diagram p6: board, bottom side, seen from below]

Size 88 x 90 mm. Coordinates in mm from the lower left corner, seen from the top.
Outline: 88,90 0,90 0,5 5,0 83,0 88,5 88,90
Copper layers (1*2*15*16): Top 0.035559375mm / dielectric 0.17018125mm / Route2 0.01778125mm / dielectric 47mil / Route15 0.01778125mm / dielectric 0.17018125mm / Bottom 0.035559375mm
Design rules "oshpark-4layer": minimum track width 5mil, minimum drill 10mil, track to track 5mil, track to pad 5mil, pad to pad 5mil, via to via 5mil, smd to smd 5mil, copper to edge 15mil, drill to drill 6mil, minimum pad ring 4mil, minimum via ring 4mil, stop-mask expansion 2.5mil, vias tented up to drill 0mil, thermal gap 10mil
Holes 2 mm at 83,5 5,5 85,72 3,72 44,87

### Footprints (pad centres in the part's own frame; a part is rotated, then mirrored left to right if it is on the bottom)
CAPACITOR-0603 = smd 0.8 x 0.8: 1 -0.75,0; 2 0.75,0
ESS_II_TYPE_LED = smd 0.8 x 0.8: P$1 -0.825,0; P$2 0.825,0
FSMJSM = smd 1.4 x 2.1: P$1 -2.25,-4.55; P$2 2.25,-4.55; P$3 -2.25,4.55; P$4 2.25,4.55
MOLEX-70553-0003 = drill 1.09 long: 1 2.545,-12.665; 2 5.085,-12.665; 3 7.625,-12.665; 4 10.165,-12.665
LQFP144_20X20 = smd 0.3 x 1: 1 -8.75,-10.8; 2 -8.25,-10.8; 3 -7.75,-10.8; 4 -7.25,-10.8; 5 -6.75,-10.8; 6 -6.25,-10.8; 7 -5.75,-10.8; 8 -5.25,-10.8; 9 -4.75,-10.8; 10 -4.25,-10.8; 11 -3.75,-10.8; 12 -3.25,-10.8; 13 -2.75,-10.8; 14 -2.25,-10.8; 15 -1.75,-10.8; 16 -1.25,-10.8; 17 -0.75,-10.8; 18 -0.25,-10.8; 19 0.25,-10.8; 20 0.75,-10.8; 21 1.25,-10.8; 22 1.75,-10.8; 23 2.25,-10.8; 24 2.75,-10.8; 25 3.25,-10.8; 26 3.75,-10.8; 27 4.25,-10.8; 28 4.75,-10.8; 29 5.25,-10.8; 30 5.75,-10.8; 31 6.25,-10.8; 32 6.75,-10.8; 33 7.25,-10.8; 34 7.75,-10.8; 35 8.25,-10.8; 36 8.75,-10.8; 73 8.75,10.8; 74 8.25,10.8; 75 7.75,10.8; 76 7.25,10.8; 77 6.75,10.8; 78 6.25,10.8; 79 5.75,10.8; 80 5.25,10.8; 81 4.75,10.8; 82 4.25,10.8; 83 3.75,10.8; 84 3.25,10.8; 85 2.75,10.8; 86 2.25,10.8; 87 1.75,10.8; 88 1.25,10.8; 89 0.75,10.8; 90 0.25,10.8; 91 -0.25,10.8; 92 -0.75,10.8; 93 -1.25,10.8; 94 -1.75,10.8; 95 -2.25,10.8; 96 -2.75,10.8; 97 -3.25,10.8; 98 -3.75,10.8; 99 -4.25,10.8; 100 -4.75,10.8; 101 -5.25,10.8; 102 -5.75,10.8; 103 -6.25,10.8; 104 -6.75,10.8; 105 -7.25,10.8; 106 -7.75,10.8; 107 -8.25,10.8; 108 -8.75,10.8 | smd 1 x 0.3: 37 10.8,-8.75; 38 10.8,-8.25; 39 10.8,-7.75; 40 10.8,-7.25; 41 10.8,-6.75; 42 10.8,-6.25; 43 10.8,-5.75; 44 10.8,-5.25; 45 10.8,-4.75; 46 10.8,-4.25; 47 10.8,-3.75; 48 10.8,-3.25; 49 10.8,-2.75; 50 10.8,-2.25; 51 10.8,-1.75; 52 10.8,-1.25; 53 10.8,-0.75; 54 10.8,-0.25; 55 10.8,0.25; 56 10.8,0.75; 57 10.8,1.25; 58 10.8,1.75; 59 10.8,2.25; 60 10.8,2.75; 61 10.8,3.25; 62 10.8,3.75; 63 10.8,4.25; 64 10.8,4.75; 65 10.8,5.25; 66 10.8,5.75; 67 10.8,6.25; 68 10.8,6.75; 69 10.8,7.25; 70 10.8,7.75; 71 10.8,8.25; 72 10.8,8.75; 109 -10.8,8.75; 110 -10.8,8.25; 111 -10.8,7.75; 112 -10.8,7.25; 113 -10.8,6.75; 114 -10.8,6.25; 115 -10.8,5.75; 116 -10.8,5.25; 117 -10.8,4.75; 118 -10.8,4.25; 119 -10.8,3.75; 120 -10.8,3.25; 121 -10.8,2.75; 122 -10.8,2.25; 123 -10.8,1.75; 124 -10.8,1.25; 125 -10.8,0.75; 126 -10.8,0.25; 127 -10.8,-0.25; 128 -10.8,-0.75; 129 -10.8,-1.25; 130 -10.8,-1.75; 131 -10.8,-2.25; 132 -10.8,-2.75; 133 -10.8,-3.25; 134 -10.8,-3.75; 135 -10.8,-4.25; 136 -10.8,-4.75; 137 -10.8,-5.25; 138 -10.8,-5.75; 139 -10.8,-6.25; 140 -10.8,-6.75; 141 -10.8,-7.25; 142 -10.8,-7.75; 143 -10.8,-8.25; 144 -10.8,-8.75
LGA-14L = smd 0.675 x 0.25: 1 -1.262,0.75; 2 -1.262,0.25; 3 -1.262,-0.25; 4 -1.262,-0.75; 8 1.262,-0.75; 9 1.262,-0.25; 10 1.262,0.25; 11 1.262,0.75 | smd 0.25 x 0.675: 5 -0.5,-1.012; 6 0,-1.012; 7 0.5,-1.012; 12 0.5,1.012; 13 0,1.012; 14 -0.5,1.012
2_PINS,3.5MM_PITCH = drill 1.2 long: 1 -1.75,0; 2 1.75,0
MOLEX-70553-0010 = drill 1.09 long: P$1 2.545,-12.665; P$2 5.085,-12.665; P$3 7.625,-12.665; P$4 10.165,-12.665; P$5 12.705,-12.665; P$6 15.245,-12.665; P$7 17.785,-12.665; P$8 20.325,-12.665; P$9 22.865,-12.665; P$10 25.405,-12.665; P$11 27.945,-12.665
RESISTOR-0603 = smd 0.6 x 0.9: P$1 -0.75,0; P$2 0.75,0
SD_MOLEX_5033981892 = smd 0.7 x 1.1: 1 4.45,-0.9; 2 5.55,-0.9; 3 6.65,-0.9; 4 7.75,-0.9; 5 8.85,-0.9; 6 9.95,-0.9; 7 11.05,-0.9; 8 12.15,-0.9 | smd 0.9 x 0.93: DLM 2.66,-13.365 | smd 1.05 x 0.78: DSM 6.925,-13.44 | smd 1.14 x 1.83: SM1 0.57,-0.915 | smd 0.86 x 2.8: SM2 13.23,-1.4 | smd 0.7 x 3.33: SM3 13.31,-12.165; SM4 0.35,-12.165
MOLEX-502046-3070 = smd 0.3 x 1: 1 9.062,-0.3; 2 8.438,-0.3; 3 7.812,-0.3; 4 7.188,-0.3; 5 6.562,-0.3; 6 5.938,-0.3; 7 5.312,-0.3; 8 4.688,-0.3; 9 4.062,-0.3; 10 3.438,-0.3; 11 2.812,-0.3; 12 2.188,-0.3; 13 1.562,-0.3; 14 0.938,-0.3; 15 0.312,-0.3; 16 -0.312,-0.3; 17 -0.938,-0.3; 18 -1.562,-0.3; 19 -2.188,-0.3; 20 -2.812,-0.3; 21 -3.438,-0.3; 22 -4.062,-0.3; 23 -4.688,-0.3; 24 -5.312,-0.3; 25 -5.938,-0.3; 26 -6.562,-0.3; 27 -7.188,-0.3; 28 -7.812,-0.3; 29 -8.438,-0.3; 30 -9.062,-0.3 | smd 1.15 x 5: NAIL1 10.775,-4.8; NAIL2 -10.775,-4.8
1X07 = drill 1.016 long: 1 -7.62,0; 2 -5.08,0; 3 -2.54,0; 4 0,0; 5 2.54,0; 6 5.08,0; 7 7.62,0
1X09 = drill 1.016 long: 1 -10.16,0; 2 -7.62,0; 3 -5.08,0; 4 -2.54,0; 5 0,0; 6 2.54,0; 7 5.08,0; 8 7.62,0; 9 10.16,0

### Placement (x,y rotation side)
C1  35.2,57 90 top
C2  46.8,57 90 top
C3  59,50.8 0 top
C4  59,38.8 0 top
C5  56.8,30 0 top
C6  47.8,27 270 top
C7  42.8,27 270 top
C8  36.2,27 270 top
C9  29,42.8 180 top
C10  21,77 0 top
C11  59,44.2 0 top
C12  41.8,57 90 top
C13  29,48 180 top
C14  29,34 180 top
C15  56,56 90 top
C16  29,36 180 top
C17  21,78.6 0 top
C18  29,38.8 180 top
C19  40,64.8 180 top
C20  44.6,67.8 90 top
CALIBRATING  25,65 90 top
ERROR_0  70,26 0 top
ERROR_1  70,28 0 top
ERROR_2  70,30 0 top
ERROR_3  70,32 0 top
ERROR_4  70,34 0 top
ERROR_5  70,36 0 top
ERROR_6  70,38 0 top
ERROR_7  70,40 0 top
ERROR_8  70,42 0 top
ERROR_9  70,44 0 top
ERROR_A  70,46 0 top
FLUSH  63,60 180 top
I2C1  27,90 0 top
IC1  44,42 270 top
IC_IMU  44,64.04 180 top
JP_3V3  21,86 180 top
LEFT_MOTOR_CONTROL  0,20.3 90 top
LEFT_MOTOR_ENCODER  0,77.29 90 top
PAUSED  29,65 90 top
POWER_ON  23,65 90 top
R1  38.2,57 270 top
R2  66,26 180 top
R3  82,18 90 top
R4  79,18 90 top
R5  66,28 180 top
R6  7,54 270 top
R7  9,54 270 top
R8  42,81 0 top
R9  42,83 0 top
R10  15,66 90 top
R11  25,48 0 top
R12  23,61 270 top
R13  27,61 270 top
R14  66,30 180 top
R15  66,32 180 top
R16  66,34 180 top
R17  25,61 270 top
R18  29,61 270 top
R19  66,36 180 top
R20  66,38 180 top
R21  66,40 180 top
R22  66,42 180 top
R23  66,44 180 top
R24  66,46 180 top
R25  58,59 180 top
R26  58,56 90 top
R27  66,76 180 top
RESET  8,60 90 top
RIGHT_MOTOR_CONTROL  88,50.79 270 top
RIGHT_MOTOR_ENCODER  88,90 270 top
RUNNING  27,65 90 top
SD1  82.6,67.71 270 top
SD_BUSY  70,76 0 top
SENSORS  44,9 0 top
ST_LINK  44,72.4 180 top
START/PAUSE  10,70 0 top
TIMING_OUT  68.2,5.8 0 top
USART2  48,90 0 top

### Tracks (layer width: path | path; a pad name or v marks a point on that pad's centre or on a via)
!RESET  (via drill 0.35)
  Top 0.3: IC1.25 29.8,38.75 C18.1 29.75,38.15 29.4,37.8 24.4,37.8 v23.2,39 | RESET.P$2 12,62.25 | 12,62.25 RESET.P$4 | v15.6,57.2 15.6,61.4 14.75,62.25 12,62.25
  Route2 0.3: ST_LINK.7 22,72.4 19.6,70 19.6,61.2 v15.6,57.2 15.6,44 16.8,42.8 19.4,42.8 v23.2,39
BOOT0
  Top 0.3: IC1.138 38.25,56.2 R1.P$2
BTN_RUN_PAUSE  (via drill 0.35)
  Top 0.3: IC1.5 31.75,48.75 31,48 C13.1 29.75,48.85 28.6,50 v22.4,50 | v16.8,50 16.8,63.45 R10.P$1 12.45,65.25 START/PAUSE.P$2 START/PAUSE.P$4
  Bottom 0.3: v22.4,50 v16.8,50
DGND  (via drill 0.35)
  Top 0.2: SD1.6 81.74,57.8
  Top 0.25: IC_IMU.3 45.89,64.29 v47,65.4 | IC_IMU.2 46.39,63.79 v47,64.4 | IC_IMU.6 44,66 v43.2,66.8 | IC_IMU.7 43.5,65.7 v42.4,66.8 | C20.2 44.55,68.6 v43.4,68.6 | C19.2 38.4,65.65 v38.4,66
  Top 0.3: C7.2 v42.8,25 | C8.2 v36.2,25 | IC1.38 35.75,32.45 v35.4,32.8 | SENSORS.29 35.56,6.76 v35.2,6.4 | SENSORS.28 36.19,6.81 v36.6,6.4 | SENSORS.2 52.44,6.96 v53.4,6 | SENSORS.4 51.19,7.99 v50.6,7.4 | C6.2 47.8,25.8 v49,24.6 | IC1.51 42.25,30.45 v41.4,29.6 | IC1.61 47.25,30.45 v46.4,29.6 | v35,4 33.42,4 SENSORS.NAIL2 | SENSORS.NAIL1 54.58,4 v53,4 | IC1.71 52.25,32.15 v51.6,32.8 | C5.2 57.55,30.75 v58.2,31.4 | C9.2 v27,42.8 | IC1.30 34.85,36.25 v35.2,36.6 | IC1.31 34.85,35.75 v35.2,35.4 | IC1.16 34.25,43.25 v35,44 | C18.2 26.8,38.8 v25,40.6 | R11.P$1 v23,48 | C1.2 v35.2,59 | R1.P$1 v38.2,59 | POWER_ON.P$2 v23,67.2 | CALIBRATING.P$2 v25,67.2 | RUNNING.P$2 v27,67.2 | PAUSED.P$2 v29,67.2 | C17.2 v23,78.6 | C10.2 v23,77 | C4.2 v61,38.8 | C11.2 v61,44.2 | IC1.83 53.35,38.25 v52.8,38.8 | IC1.94 53.45,43.75 v52.8,44.4 | C3.2 v61,50.8 | ERROR_0.P$2 v72.2,26 | ERROR_1.P$2 v72.2,28 | ERROR_2.P$2 v72.2,30 | ERROR_3.P$2 v72.2,32 | ERROR_4.P$2 v72.2,34 | ERROR_5.P$2 v72.2,36 | ERROR_6.P$2 v72.2,38 | ERROR_7.P$2 v72.2,40 | ERROR_8.P$2 v72.2,42 | ERROR_9.P$2 v72.2,44 | IC1.143 35.75,53.55 v36.4,54.2 | C12.2 v41.8,59 | C2.2 v46.8,59 | IC1.107 56.95,50.25 v57.4,49.8 | IC1.120 47.25,51.65 v46.8,51.2 | IC1.130 42.25,51.65 v41.8,51.2 | C16.2 v27,36 | C14.2 v27,34 | ERROR_A.P$2 v72.2,46 | R4.P$1 v79,16 | R3.P$1 v82,16 | v3.6,55.4 3.6,57.6 RESET.P$3 RESET.P$1 12.4,57.6 v12.4,55.4 | v9.6,74.8 8,74.8 START/PAUSE.P$3 START/PAUSE.P$1 7.8,65.4 v9.6,65.4 | R6.P$1 v7,56 | R7.P$1 v9,56 | R25.P$1 58.8,59.05 v58.8,60.4 | v66.8,55.4 65.3,55.4 FLUSH.P$3 FLUSH.P$1 65.3,64.6 v66.8,64.6 | SD_BUSY.P$2 v72.2,76
  Top 0.4: SD1.DLM 69.69,64.6 v70.6,64.6
  Top 0.55: 81.74,57.8 v83,57.8 v84.2,57.8
  pour Bottom: 1,89 1,6 6,1 82.12,1.12 87,6 87,89
ERROR_0
  Top 0.3: IC1.76 57.65,34.75 61,31.4 61,26.4 61.4,26 R2.P$2
ERROR_1
  Top 0.3: IC1.77 57.95,35.25 60.1,33.1 61.6,31.6 61.6,28.4 62,28 R5.P$2
ERROR_2
  Top 0.3: R14.P$2 62.8,30 62.6,30 62.2,30.4 62.2,31.8 58.25,35.75 IC1.78
ERROR_3
  Top 0.3: IC1.79 58.55,36.25 62.8,32 R15.P$2
ERROR_4
  Top 0.3: IC1.80 58.85,36.75 61.6,34 R16.P$2
ERROR_5
  Top 0.3: R19.P$2 62.8,36 62,36.8 62,40 61.25,40.75 IC1.88
ERROR_6
  Top 0.3: R20.P$2 63.2,38 62.6,38.6 62.6,40.2 61.55,41.25 IC1.89
ERROR_7
  Top 0.3: R21.P$2 63.6,40 61.85,41.75 IC1.90
ERROR_8
  Top 0.3: R22.P$2 62.4,42 62.15,42.25 IC1.91
ERROR_9
  Top 0.3: IC1.92 64,42.75 R23.P$2
ERROR_10
  Top 0.3: IC1.93 62.25,43.25 62.4,43.4 62.4,45.2 63.2,46 R24.P$2
I2C_SCL
  Top 0.3: R9.P$1 37,83 34.62,80.62 I2C1.3 34.62,63.97 38.4,60.2 42,60.2 42.75,59.45 IC1.129
I2C_SDA
  Top 0.3: R8.P$1 38.8,81 37.16,79.36 I2C1.4 37.6,76.9 37.6,62 38.8,60.8 42.2,60.8 43.25,59.75 IC1.128
IMU_!CS
  Top 0.25: IC_IMU.12 43.5,60.9 43.75,60.65 IC1.127
LED_CALIBRATING
  Top 0.3: IC1.3 30.85,49.75 29.4,51.2 25.4,51.2 25,51.6 R17.P$2
LED_PAUSED
  Top 0.3: IC1.140 37.25,59.75 36.8,60.2 29.05,60.2 R18.P$2
LED_POWER_ON
  Top 0.3: IC1.4 30.35,49.25 29,50.6 23.4,50.6 23,51 R12.P$2
LED_RUNNING
  Top 0.3: IC1.1 32.25,50.75 32,51 32,58.8 31.8,59 27.6,59 27,59.6 R13.P$2
LM_!D2
  Top 0.3: IC1.12 17.45,45.25 17.2,45 17.2,36 | 17.2,36 | 17.2,36 14.21,33.01 LEFT_MOTOR_CONTROL.P$5
LM_!SF
  Top 0.3: IC1.10 16.65,46.25 16,45.6 16,40 | 16,40 | 16,40 14.09,38.09 LEFT_MOTOR_CONTROL.P$7
LM_D1
  Top 0.3: IC1.11 17.15,45.75 16.6,45.2 16.6,37.4 14.74,35.55 LEFT_MOTOR_CONTROL.P$6
LM_EN
  Top 0.3: 15.4,44.8 | 15.4,44.8 15.4,44.2 14.37,43.16 LEFT_MOTOR_CONTROL.P$9 | IC1.7 32.15,47.75 31.2,46.8 16.2,46.8 15.4,46 15.4,44.8
LM_ENC_A  (via drill 0.35)
  Top 0.3: IC1.60 v46.75,32.75 | LEFT_MOTOR_ENCODER.3 14.88,84.92 17,82.8 17,72.6 20.6,69 v20.6,48
  Route2 0.3: v20.6,48 22.2,46.4 36,46.4 46.75,35.65 v46.75,32.75
LM_ENC_B  (via drill 0.35)
  Top 0.3: IC1.2 31.55,50.25 28.6,53.2 v26.4,53.2 | v19.2,53.2 18.6,53.2 18.4,53.4 18.4,68.72 15.4,71.72 15.4,81 14.02,82.39 LEFT_MOTOR_ENCODER.2
  Route2 0.3: v19.2,53.2 v26.4,53.2
LM_INV
  Top 0.3: LEFT_MOTOR_CONTROL.P$11 10.76,48.24 9,50 R7.P$2
LM_PWM_1  (via drill 0.35)
  Top 0.3: v18,44.4 18,34 14.46,30.47 LEFT_MOTOR_CONTROL.P$4 | IC1.141 36.75,51.15 v36.6,51
  Route2 0.3: v36.6,51 20.2,51 18,48.8 v18,44.4
LM_PWM_2  (via drill 0.35)
  Top 0.3: v18.8,44.4 18.8,32.2 14.53,27.92 LEFT_MOTOR_CONTROL.P$3 | IC1.142 36.25,51.85 35.2,50.8 v35.2,49.2
  Route2 0.3: v35.2,49.2 20,49.2 18.8,48 v18.8,44.4
LM_SLEW
  Top 0.3: LEFT_MOTOR_CONTROL.P$10 10.29,45.7 7,49 R6.P$2
N$3
  Top 0.3: ERROR_0.P$1 R2.P$1
N$9
  Top 0.3: R5.P$1 ERROR_1.P$1
N$10
  Top 0.3: R12.P$1 POWER_ON.P$1
N$11
  Top 0.3: R11.P$2 C13.2
N$12
  Top 0.3: R13.P$1 RUNNING.P$1
N$13
  Top 0.3: ERROR_2.P$1 R14.P$1
N$14
  Top 0.3: R15.P$1 ERROR_3.P$1
N$15
  Top 0.3: ERROR_4.P$1 R16.P$1
N$16
  Top 0.3: R17.P$1 CALIBRATING.P$1
N$17
  Top 0.3: R18.P$1 PAUSED.P$1
N$18
  Top 0.3: R19.P$1 ERROR_5.P$1
N$19
  Top 0.3: ERROR_6.P$1 R20.P$1
N$20
  Top 0.3: ERROR_7.P$1 R21.P$1
N$21
  Top 0.3: R22.P$1 ERROR_8.P$1
N$22
  Top 0.3: R23.P$1 ERROR_9.P$1
N$23
  Top 0.3: R24.P$1 ERROR_A.P$1
N$53
  Top 0.3: C15.2 56,57.75 R25.P$2
N$55
  Top 0.3: R27.P$1 SD_BUSY.P$1
RM_!D2  (via drill 0.35)
  Top 0.3: IC1.74 56.85,33.75 v57,33.6
  Route2 0.3: 73.2,37 68.6,37 65.2,33.6 v57,33.6 | 73.2,37 | 73.2,37 74.28,38.09 RIGHT_MOTOR_CONTROL.P$5
RM_!SF  (via drill 0.35)
  Top 0.3: IC1.70 51.75,30.25 | 51.75,30.25 | 51.75,30.25 51.75,29.85 52.6,29 v59.8,29
  Route2 0.3: v59.8,29 64.6,29 68.61,33.01 RIGHT_MOTOR_CONTROL.P$7
RM_D1  (via drill 0.35)
  Top 0.3: IC1.73 55.75,33.25 56.4,32.6 v57,32.6
  Route2 0.3: v57,32.6 66.2,32.6 68.6,35 73.4,35 73.94,35.55 RIGHT_MOTOR_CONTROL.P$6
RM_EN  (via drill 0.35)
  Top 0.3: IC1.69 51.25,29.35 52.6,28 v59.8,28
  Route2 0.3: v59.8,28 61,28 62,27 73.6,27 74.53,27.92 RIGHT_MOTOR_CONTROL.P$9
RM_ENC_A  (via drill 0.35)
  Top 0.3: IC1.81 60.15,37.25 v61,36.4
  Route2 0.3: v63.6,44.4 63.6,55 61.8,56.8 61.8,80 63.7,81.9 63.8,82 64.17,82.38 RIGHT_MOTOR_ENCODER.3
  Bottom 0.3: v61,36.4 61.8,36.4 63,37.6 63,42 63.6,42.6 v63.6,44.4
RM_ENC_B  (via drill 0.35)
  Top 0.3: IC1.75 52.35,34.25 51.6,35 v51.6,41.8
  Route2 0.3: v51.6,41.8 52.4,42.6 61.8,42.6 62.2,43 62.2,54.2 60.4,56 60.4,81.8 63.52,84.92 RIGHT_MOTOR_ENCODER.2
RM_INV
  Top 0.3: RIGHT_MOTOR_CONTROL.P$11 78.16,22.84 79,22 R4.P$2
RM_PWM_1  (via drill 0.35)
  Top 0.3: IC1.48 40.75,35.35 v45.8,40.4 | v64,41 74.96,41 RIGHT_MOTOR_CONTROL.P$4
  Route2 0.3: v45.8,40.4 46.4,41 v64,41
RM_PWM_2  (via drill 0.35)
  Top 0.3: IC1.82 v60.95,37.75
  Route2 0.3: v60.95,37.75 67.55,37.75 69.8,40 69.8,41.8 71,43 75.17,43 RIGHT_MOTOR_CONTROL.P$3
RM_SLEW
  Top 0.3: RIGHT_MOTOR_CONTROL.P$10 80.61,25.38 82,24 R3.P$2
SD_BUSY
  Top 0.3: IC1.118 48.25,60.25 56.6,68.6 56.6,73.6 57.8,74.8 64.05,74.8 R27.P$2
SD_FLUSH  (via drill 0.35)
  Top 0.3: v56,54 C15.1 R26.P$1 60.55,55.25 60.65,55.35 | 60.65,55.35 FLUSH.P$4 | FLUSH.P$2 FLUSH.P$4 | FLUSH.P$4 60.65,55.35 | v52.8,48.4 53.4,48.4 53.75,48.75 IC1.104
  Route2 0.3: v56,54 52.8,50.8 v52.8,48.4
SDMMC1_CK
  Top 0.2: IC1.113 50.75,51.65 51,51.4 56.6,51.4 58.4,53.2 86,53.2 86.4,53.6 86.4,57.8 85.4,58.8 81.76,58.8 SD1.5
SDMMC1_CMD
  Top 0.2: SD1.3 85.06,61.06 85.4,61.4 85.4,68.2 81.8,71.8 67.4,71.8 66.6,71.8 61.25,71.8 49.25,59.8 IC1.116
SDMMC1_D0  (via drill 0.35)
  Top 0.2: v85,54 85,56.2 84.54,56.66 SD1.7 | IC1.98 57.55,45.75 58.8,47 63.2,47 66.6,50.4 84.2,50.4 85,51.2 v85,52.4
  Route2 0.2: v85,54 v85,52.4
SDMMC1_D1  (via drill 0.35)
  Top 0.2: v83.6,54 83.6,55.4 83.44,55.56 SD1.8 | IC1.99 56.65,46.25 58.4,48 62,48 65.8,51.8 83,51.8 v83.6,52.4
  Route2 0.2: v83.6,54 v83.6,52.4
SDMMC1_D2
  Top 0.2: SD1.1 81.7,63.9 76.6,69 68.6,69 68.2,69 62.4,69 52.8,59.4 52.8,56.4 51.75,55.35 IC1.111
SDMMC1_D3
  Top 0.2: IC1.112 51.25,59.85 61.8,70.4 67.4,70.4 67.6,70.4 81.2,70.4 83.8,67.8 83.8,62.6 83.36,62.16 SD1.2
SENSOR_1
  Top 0.3: IC1.46 39.75,25.45 41,24.2 47.6,24.2 50.56,21.24 SENSORS.5
SENSOR_2
  Top 0.3: IC1.45 39.25,25.15 40.8,23.6 47.2,23.6 49.94,20.86 SENSORS.6
SENSOR_3
  Top 0.3: IC1.44 38.75,24.85 40.6,23 46.8,23 49.31,20.49 SENSORS.7
SENSOR_4
  Top 0.3: IC1.43 38.25,24.55 40.4,22.4 46.4,22.4 48.69,20.11 SENSORS.8
SENSOR_5
  Top 0.3: IC1.42 37.75,24.25 40.2,21.8 46,21.8 48.06,19.74 SENSORS.9
SENSOR_6
  Top 0.3: IC1.41 37.25,23.95 38,23.2 40,21.2 45.6,21.2 47.44,19.36 SENSORS.10
SENSOR_7  (via drill 0.35)
  Top 0.3: v37,22.8 37,22.2 38.6,20.6 45.2,20.6 46.81,18.99 SENSORS.11 | IC1.40 36.75,32.55 v37,32.8
  Route2 0.3: v37,32.8 v37,22.8
SENSOR_8
  Top 0.3: SENSORS.12 46.19,18.61 44.8,20 38.4,20 33,25.4 33,27.8 35.25,30.05 IC1.37
SENSOR_9
  Top 0.3: IC1.36 32.45,33.25 32.4,33.2 32.4,25.2 38.2,19.4 44.4,19.4 45.56,18.24 SENSORS.13
SENSOR_10
  Top 0.3: IC1.35 32.15,33.75 31.8,33.4 31.8,25 38,18.8 44,18.8 44.94,17.86 SENSORS.14
SENSOR_11
  Top 0.3: IC1.34 31.85,34.25 31.4,33.8 31.2,33.6 31.2,27.8 | 31.2,27.8 | 31.2,27.8 31.2,24.8 37.8,18.2 43.6,18.2 44.31,17.49 SENSORS.15
SENSOR_12  (via drill 0.35)
  Top 0.3: v30.4,32 30.4,24.8 37.6,17.6 | 37.6,17.6 | 37.6,17.6 43.2,17.6 43.69,17.11 SENSORS.16 | IC1.29 32.15,36.75 v31.8,36.4
  Route2 0.3: v30.4,32 30.4,35 v31.8,36.4
SENSOR_13  (via drill 0.35)
  Top 0.3: SENSORS.17 43.06,16.74 42.8,17 | 36.4,18 36.8,17.6 37.4,17 42.6,17 | 42.8,17 42.6,17 | 36.4,18 | 36.4,18 29.6,24.8 v29.6,32 | 42.8,17 42.6,17 | IC1.28 31.25,37.25 v31,37
  Route2 0.3: v31,37 29.6,35.6 v29.6,32
SENSOR_14  (via drill 0.35)
  Top 0.3: SENSORS.18 42.44,16.16 42.2,16.4 37.2,16.4 28.8,24.8 v28.8,32 | IC1.27 v30.35,37.75
  Route2 0.3: v28.8,32 28.8,36.2 v30.35,37.75
SENSOR_15  (via drill 0.35)
  Top 0.3: SENSORS.19 41.8,11.71 41.8,15.6 41.6,15.8 37,15.8 28,24.8 v28,32 | IC1.26 34.85,38.25 v35,38.4
  Route2 0.3: v28,32 28,36.4 30,38.4 v35,38.4
SENSOR_16  (via drill 0.35)
  Top 0.3: SENSORS.20 41.2,11.71 41.2,15 41,15.2 36.8,15.2 26,26 v26,36.8 | IC1.22 32.45,40.25 v31.8,39.6
  Route2 0.3: v26,36.8 27.2,38 28.4,38 30,39.6 v31.8,39.6
SENSOR_17  (via drill 0.35)
  Top 0.3: SENSORS.21 40.56,14.44 40.4,14.6 36.6,14.6 25.2,26 v25.2,36.8 | v25.2,36.8 | IC1.21 34.45,40.75 v35,40.2
  Route2 0.3: v25.2,36.8 28.6,40.2 v35,40.2
SENSOR_18  (via drill 0.35)
  Top 0.3: SENSORS.22 39.94,13.86 39.8,14 36.4,14 24.4,26 v24.4,36.8 | IC1.20 34.95,41.25 v35,41.2
  Route2 0.3: v24.4,36.8 28.4,40.8 34.6,40.8 v35,41.2
SENSOR_19  (via drill 0.35)
  Top 0.3: SENSORS.23 39.31,13.29 39.2,13.4 36.2,13.4 23.6,26 v23.6,36.8 | IC1.19 31.65,41.75 v31.6,41.8
  Route2 0.3: v23.6,36.8 28.6,41.8 v31.6,41.8
SENSOR_20  (via drill 0.35)
  Top 0.3: SENSORS.24 38.69,12.71 38.6,12.8 36,12.8 22.8,26 v22.8,36.8 | IC1.18 34.45,42.25 v35,42.8
  Route2 0.3: v22.8,36.8 28.8,42.8 v35,42.8
SENSOR_21
  Top 0.3: SENSORS.25 38.06,12.14 38,12.2 35.8,12.2 22,26 22,42.4 23.35,43.75 IC1.15
SENSOR_22
  Top 0.3: SENSORS.26 37.44,11.56 37.4,11.6 35.6,11.6 21.4,25.8 21.4,42.6 23.05,44.25 IC1.14
SENSOR_23
  Top 0.3: SENSORS.27 36.81,10.99 36.8,11 35.4,11 20.8,25.6 20.8,42.8 22.75,44.75 IC1.13
SPI3_MISO  (via drill 0.35)
  Top 0.25: IC1.125 44.75,54.15 v45.2,54.6 | IC_IMU.1 46.91,63.29 v47,63.2
  Route2 0.25: v45.2,54.6 45.2,55.6 45,55.8 44.6,56.2 44.6,60 47,62.4 v47,63.2
SPI3_MOSI  (via drill 0.35)
  Top 0.25: IC1.126 44.25,55.05 v44.4,55.2 | IC_IMU.14 44.5,61.9 v44.8,61.6
  Route2 0.25: v44.4,55.2 44.2,55.4 44.2,61 v44.8,61.6
SPI3_SCK
  Top 0.25: IC1.124 45.25,53.45 46,54.2 46,55.4 45,56.4 45,60.2 44,61.2 IC_IMU.13
ST_LINK_RX  (via drill 0.35)
  Top 0.3: IC1.101 56.45,47.25 58.4,49.2 v60,49.2
  Route2 0.3: v60,49.2 60,54.2 57.6,56.6 v57.6,72.4
  Bottom 0.3: ST_LINK.1 v57.6,72.4
ST_LINK_TX  (via drill 0.35)
  Top 0.3: IC1.102 51.25,47.75 v50.6,48.4
  Route2 0.3: v50.6,48.4 50.2,48.8 50.2,68.2 49,69.4 49,72.32 ST_LINK.2
SWO  (via drill 0.35)
  Top 0.3: IC1.133 40.75,53.85 39.4,55.2 v39.4,59
  Route2 0.3: v39.4,59 39.4,69.4 41.46,71.46 ST_LINK.5
TCK  (via drill 0.35)
  Top 0.3: IC1.109 52.75,53.75 54.6,55.6 v54.6,59.4
  Route2 0.3: v54.6,59.4 54.6,74.2 54,74.8 47.6,74.8 46.54,73.74 ST_LINK.3
TIMING_OUT_0  (via drill 0.35)
  Top 0.3: IC1.55 44.25,27.35 v46.2,25.4 | v58.2,16.6 58.2,5.96 TIMING_OUT.1
  Route2 0.3: v46.2,25.4 53.8,25.4 58.2,21 v58.2,16.6
TIMING_OUT_1  (via drill 0.35)
  Top 0.3: IC1.56 44.75,27.65 v46.2,26.2 | v60.6,16.6 60.6,5.82 TIMING_OUT.2
  Route2 0.3: v46.2,26.2 54.2,26.2 60.6,19.8 v60.6,16.6
TIMING_OUT_2  (via drill 0.35)
  Top 0.3: IC1.57 45.25,27.95 v46.2,27 | v63.2,16.6 63.2,5.88 TIMING_OUT.3
  Route2 0.3: v46.2,27 54.6,27 63.2,18.4 v63.2,16.6
TIMING_OUT_3
  Top 0.3: IC1.64 48.75,26.85 57.8,17.8 64.8,17.8 65.66,16.94 TIMING_OUT.4
TIMING_OUT_4
  Top 0.3: IC1.65 49.25,27.15 57,19.4 65.6,19.4 68.2,16.8 TIMING_OUT.5
TIMING_OUT_5
  Top 0.3: IC1.66 49.75,27.45 56.2,21 66.6,21 70.74,16.86 TIMING_OUT.6
TIMING_OUT_6
  Top 0.3: TIMING_OUT.7 73.28,16.92 67.6,22.6 55.45,22.6 50.25,27.8 IC1.67
TIMING_OUT_7
  Top 0.3: IC1.68 50.75,28.05 54.6,24.2 68.6,24.2 75.82,16.98 TIMING_OUT.8
TMS  (via drill 0.35)
  Top 0.3: IC1.105 52.55,49.25 52,49.8 48.8,49.8 v48.4,50.2
  Route2 0.3: v48.4,50.2 48.4,67.6 46,70 45,70 44,71 ST_LINK.4
USART2_RX  (via drill 0.35)
  Top 0.3: IC1.110 52.25,54.65 v52.8,55.2
  Route2 0.3: v52.8,55.2 55.8,58.2 55.8,77.16 USART2.3
USART2_TX
  Top 0.3: IC1.119 47.75,60.55 53.09,65.89 USART2.2
VDD  (via drill 0.35)
  Top 0.2: SD1.4 81.74,60
  Top 0.25: C2.1 46.55,56.25 v45.8,57 | IC_IMU.8 C19.1 40.75,65.95 v40.8,66 | IC_IMU.5 44.5,66.95 C20.1 45.95,67.05 v46,67
  Top 0.3: IC1.52 42.75,27.8 C7.1 42.25,27.75 v41.4,28.6 | IC1.62 47.75,27.8 C6.1 47.25,27.75 v46.4,28.6 | IC1.39 36.25,27.8 C8.1 35.55,27.75 v34.8,27 | IC1.33 31.55,34.75 30.8,34 C14.1 29.75,33.35 29.4,33 v27,33 | IC1.17 29.8,42.75 C9.1 29.75,42.15 29.4,41.8 v26.4,41.8 | IC1.144 35.25,56.2 C1.1 34.55,56.25 v33.8,57 | IC1.131 41.75,56.2 C12.1 41.15,56.25 v40.4,57 | IC1.121 46.75,56.2 C2.1 | IC1.108 58.2,50.75 C3.1 58.25,51.25 v59,52 | IC1.95 58.2,44.25 C11.1 58.25,44.65 v59,45.4 | IC1.84 58.2,38.75 C4.1 58.25,39.25 v59,40 | IC1.32 31.55,35.25 30.8,36 C16.1 29.75,36.65 29.4,37 v27.4,37 | SENSORS.30 34.94,7.94 v34.4,7.4 | SENSORS.1 53.06,7.74 v53.4,7.4 | SENSORS.3 51.81,6.81 v51,6 | IC1.72 52.75,30 C5.1 56.05,30.75 v55.4,31.4 | IC1.6 34.75,48.25 v35,48 | R10.P$2 v15,68.2 | C17.1 v19,78.6 | C10.1 v19,77 | R9.P$2 v44,83 | R8.P$2 v44,81 | IC1.106 56.05,49.75 v56.4,49.4 | R26.P$2 58.35,56.75 v59.2,57.6
  Top 0.55: 81.74,60 v83,60 v84.2,60
  pour Route15: 6,1 82,1 87,6 87,89 1,89 1,6

### Text on the board
tNames: - | + | B | A | RIGHT / MOTOR / ENCODER | A | B | + | - | + | - | LEFT / MOTOR / ENCODER | - | + | SCL | SDA | - | TX | RX | + | RST | - | SWO | TMS | TCK | TX | RX | INV | SLEW | EN | !SF | D1 | !D2 | IN1 | IN2 | + | - | REV 1.1 2018-10-29 | 1 | 0 | 1 | 2 | 3 | 4 | 5 | 6 | 7 | GND
bNames: - | + | IN2 | IN1 | !D2 | D1 | !SF | EN | SLEW | INV